# EAGLE design 11A-001 (EAGLE 6.3)

## Sheet 1 of 5
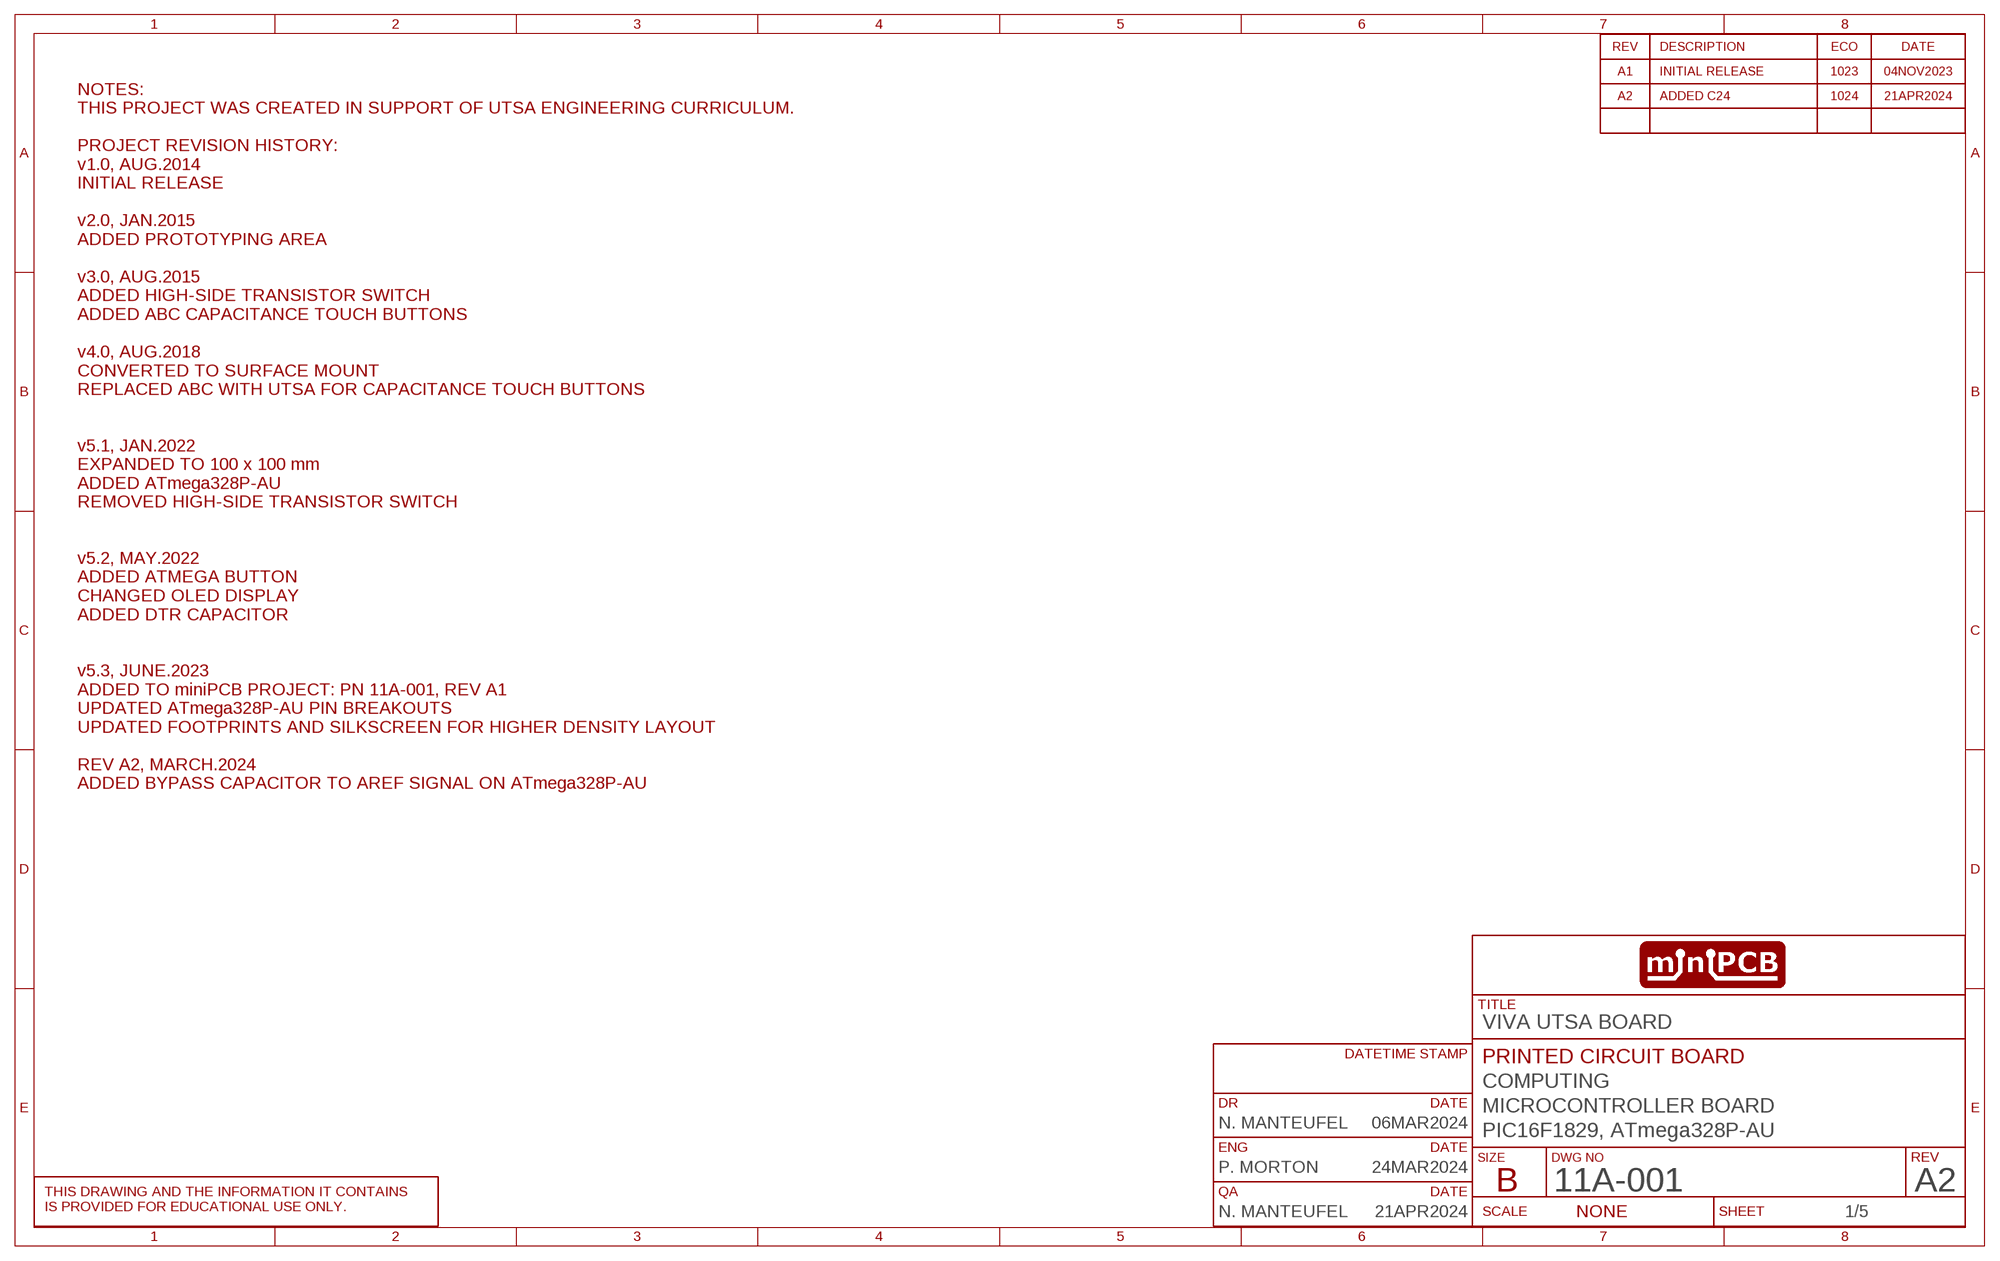
[diagram p0: schematic, sheet 1]
SHEET1 (SCHEMATIC): CIRCUIT_CATEGORY: COMPUTING; CIRCUIT_NAME: MICROCONTROLLER BOARD; CIRCUIT_VARIANT: PIC16F1829, ATmega328P-AU; DR: N. MANTEUFEL; DR_DATE: 06MAR2024; ENG: P. MORTON; ENG_DATE: 24MAR2024; PCB_PCBA: PRINTED CIRCUIT BOARD; QA: N. MANTEUFEL; QA_DATE: 21APR2024; REVA: A1; REVA_DATE: 04NOV2023; REVA_ECO: 1023; REVB: A2; REVB_DATE: 21APR2024; REVB_DESCRIPTION: ADDED C24; REVB_ECO: 1024; REVISION: A2; TITLE: VIVA UTSA BOARD

### Notes on the sheet
- NOTES:
  THIS PROJECT WAS CREATED IN SUPPORT OF UTSA ENGINEERING CURRICULUM.
  
  PROJECT REVISION HISTORY:
  v1.0, AUG.2014
  INITIAL RELEASE
  
  v2.0, JAN.2015
  ADDED PROTOTYPING AREA
  
  v3.0, AUG.2015
  ADDED HIGH-SIDE TRANSISTOR SWITCH
  ADDED ABC CAPACITANCE TOUCH BUTTONS
  
  v4.0, AUG.2018
  CONVERTED TO SURFACE MOUNT
  REPLACED ABC WITH UTSA FOR CAPACITANCE TOUCH BUTTONS
  
  
  v5.1, JAN.2022
  EXPANDED TO 100 x 100 mm
  ADDED ATmega328P-AU
  REMOVED HIGH-SIDE TRANSISTOR SWITCH
  
  
  v5.2, MAY.2022
  ADDED ATMEGA BUTTON
  CHANGED OLED DISPLAY
  ADDED DTR CAPACITOR
  
  
  v5.3, JUNE.2023
  ADDED TO miniPCB PROJECT: PN 11A-001, REV A1
  UPDATED ATmega328P-AU PIN BREAKOUTS
  UPDATED FOOTPRINTS AND SILKSCREEN FOR HIGHER DENSITY LAYOUT
  
  REV A2, MARCH.2024
  ADDED BYPASS CAPACITOR TO AREF SIGNAL ON ATmega328P-AU

## Sheet 2 of 5
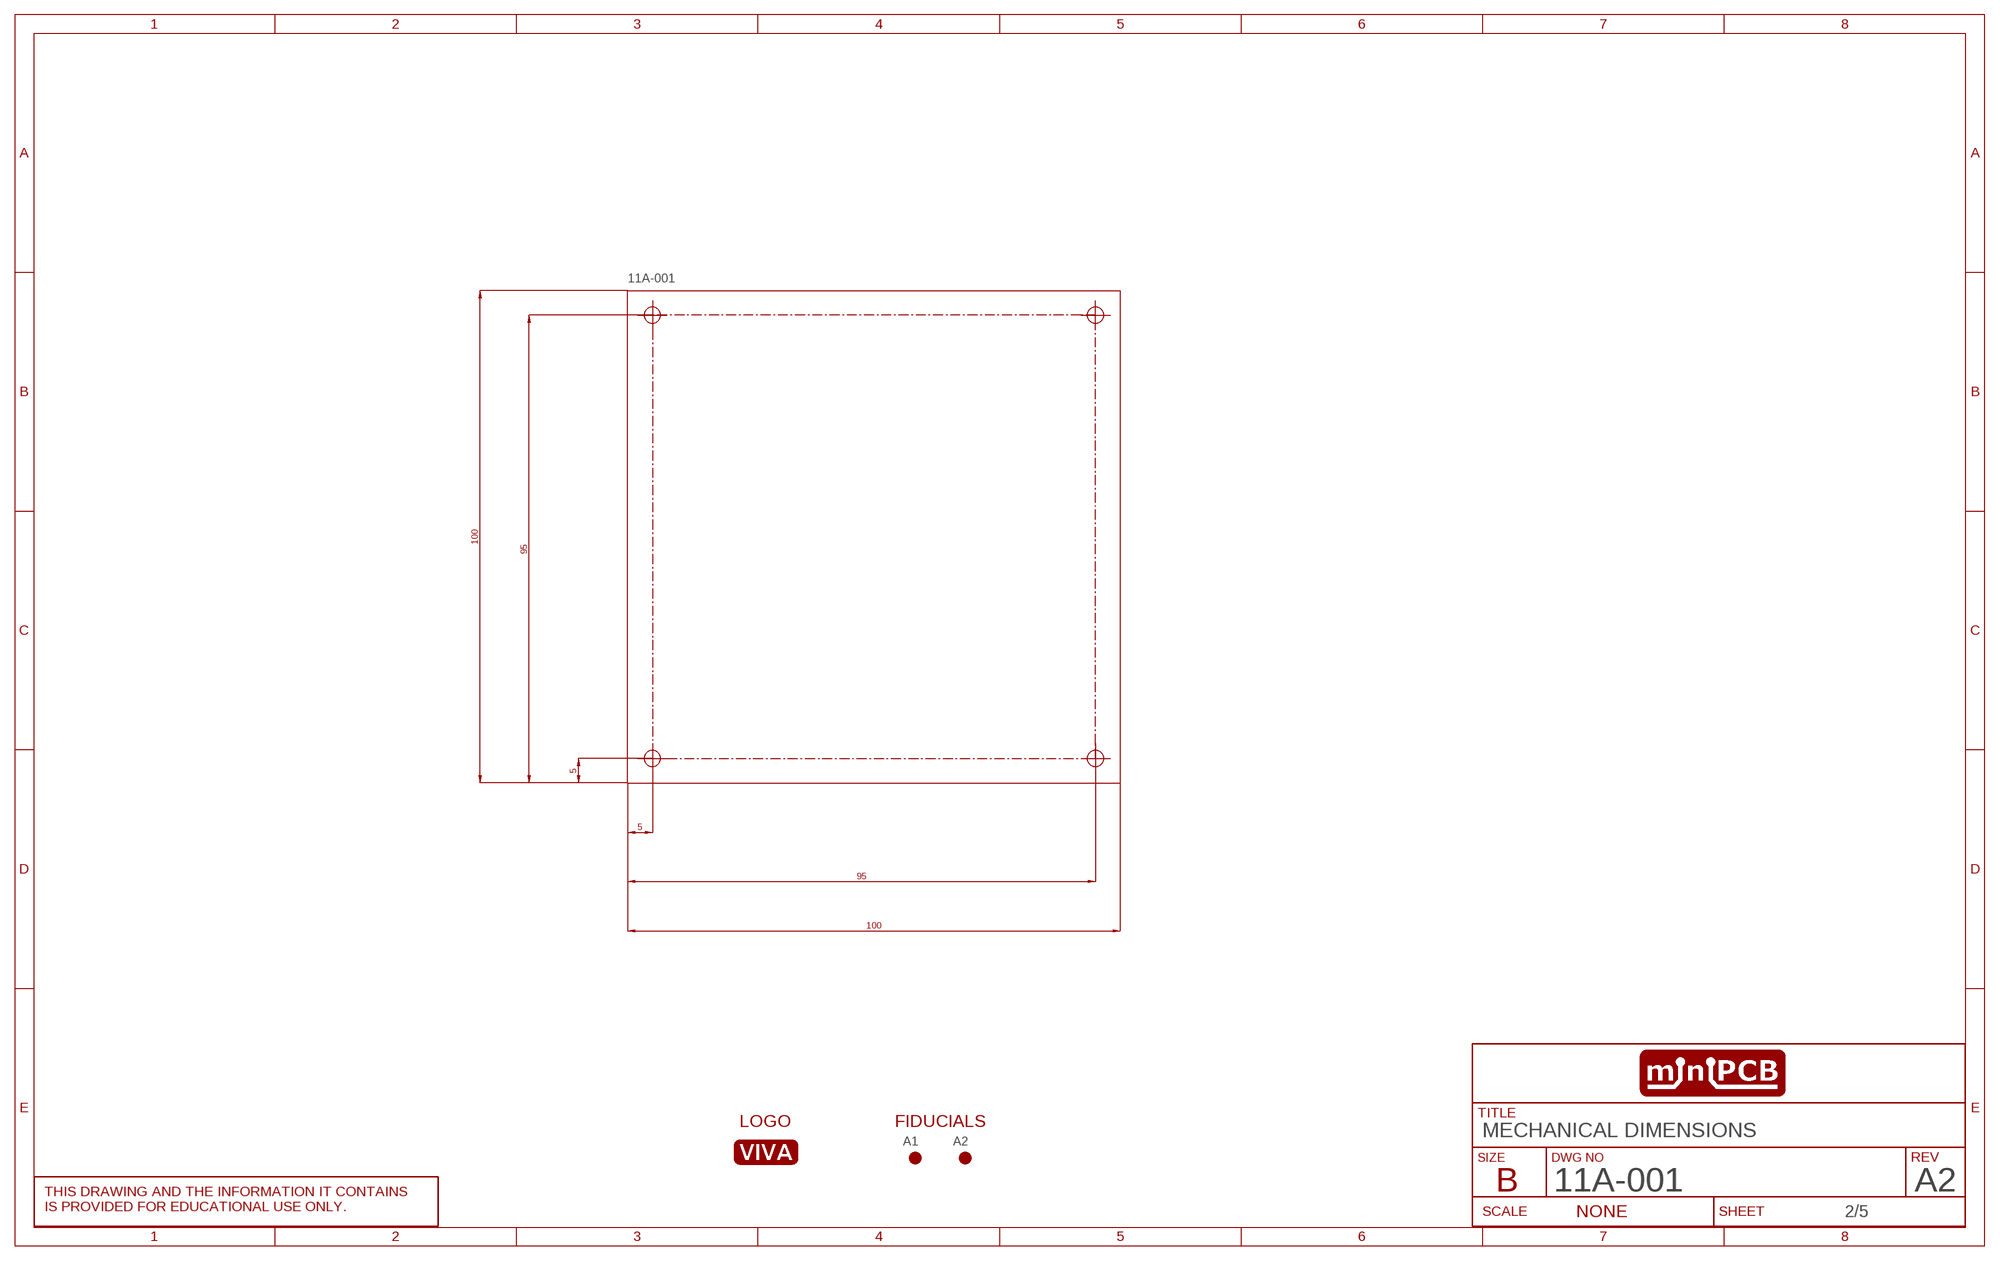
[diagram p1: schematic, sheet 2]
SHEET2 (SCHEMATIC): CIRCUIT_CATEGORY: COMPUTING; CIRCUIT_NAME: MICROCONTROLLER BOARD; CIRCUIT_VARIANT: PIC16F1829, ATmega328P-AU; DR: N. MANTEUFEL; DR_DATE: 31JUL2023; ENG: P. MORTON; ENG_DATE: 31JUL2023; PCB_PCBA: PRINTED CIRCUIT BOARD; REVA: A; REVISION: A2; TITLE: MECHANICAL DIMENSIONS

### Parts
-  11A-001  PCB_100X100  [PCB_100X100]
A1  FIDUCIAL  [FIDUCIAL]
A2  FIDUCIAL  [FIDUCIAL]
U$2  VIVA_LOGO  [VIVA_LOGO]

### Notes on the sheet
- LOGO | FIDUCIALS

## Sheet 3 of 5
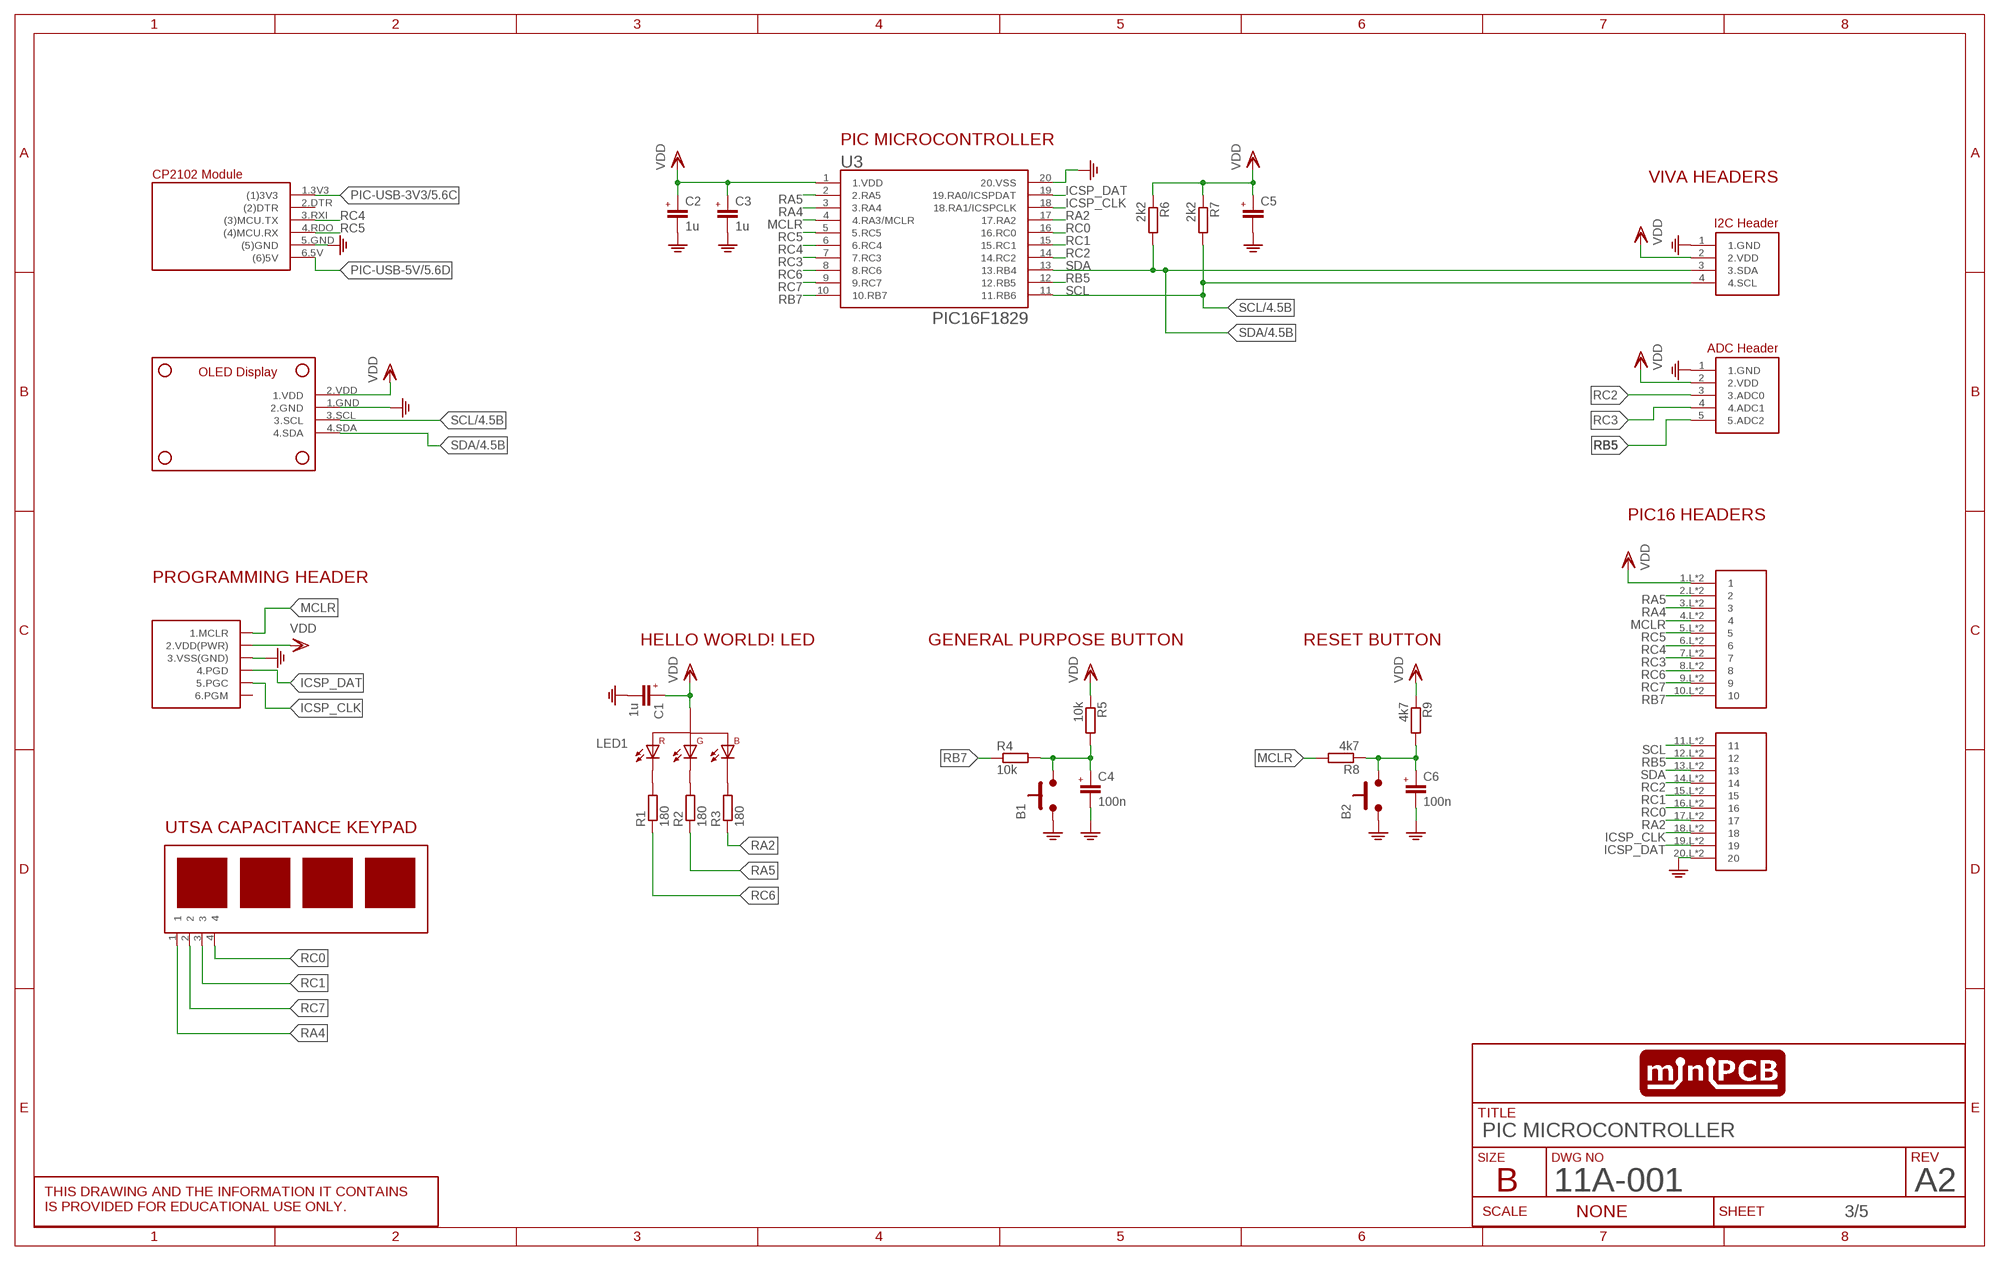
[diagram p2: schematic, sheet 3]
SHEET3 (SCHEMATIC): CIRCUIT_CATEGORY: COMPUTING; CIRCUIT_NAME: MICROCONTROLLER BOARD; CIRCUIT_VARIANT: PIC16F1829, ATmega328P-AU; DR: N. MANTEUFEL; DR_DATE: 31JUL2023; ENG: P. MORTON; ENG_DATE: 31JUL2023; PCB_PCBA: PRINTED CIRCUIT BOARD; REVA: A; REVISION: A2; TITLE: PIC MICROCONTROLLER

### Parts
$3_73_$  VIVA_OLEDGND  [VIVA_OLED-I2C-ALT]
B1  PUSHBUTTON6X6MM  [6X6MM]
B2  PUSHBUTTON6X6MM  [6X6MM]
C1  1u  C0805  [C0805]
C2  1u  C0805  [C0805]
C3  1u  C0805  [C0805]
C4  100n  C0805  [C0805]
C5  C0805  [C0805]
C6  100n  C0805  [C0805]
J1  PICKIT3  [PICKIT3]
J2  VIVA-HEADER-ADC-PIC16  [VIVA-HEADER-ADC-PIC16]
LED1  LED_RGBLTST-C19FD1WT  [0805_RGB]
R1  180  R-EU__R0805  [R0805]
R2  180  R-EU__R0805  [R0805]
R3  180  R-EU__R0805  [R0805]
R4  10k  R-EU__R0805  [R0805]
R5  10k  R-EU__R0805  [R0805]
R6  2k2  R-EU__R0805  [R0805]
R7  2k2  R-EU__R0805  [R0805]
R8  4k7  R-EU__R0805  [R0805]
R9  4k7  R-EU__R0805  [R0805]
U1  VIVA_UTSA-KEYPADV5  [VIVA_UTSA-KEYPAD-V5]
U2  VIVA_USB-TTL  [VIVA_USB_TTL_SUBTEXT]
U3  PIC16F1829  PIC16F1829300  [SOP20-NEW]
U4  VIVA-HEADER-I2C-RA  [VIVA-HEADER-I2C-RA]
U5  VIVA_PIC16BOARD  [VIVA_PIC16]

### Nets
B1-CAP: B1.3.B B1.4.B C4.1(+) R4.2 R5.2
GND: $3_73_$.1.GND(2.GND) B1.1.A B1.2.A B2.1.A B2.2.A C1.2(-) C2.2(-) C3.2(-) C4.2(-) C5.2(-) C6.2(-) J1.3(3.VSS(GND)) J2.1(1.GND) U2.5.GND((5)GND) U3.20(20.VSS) U4.1(1.GND) U5.20.L U5.20.R ; also sheet 4,5
ICSP_CLK: J1.5(5.PGC) U3.18(18.RA1/ICSPCLK) U5.18.L U5.18.R
ICSP_DAT: J1.4(4.PGD) U3.19(19.RA0/ICSPDAT) U5.19.L U5.19.R
MCLR: J1.1(1.MCLR) R8.2 U3.4(4.RA3/MCLR) U5.4.L U5.4.R
MCLR_CAP: B2.3.B B2.4.B C6.1(+) R8.1 R9.2
N$4: LED1.2(1.R-) R1.2
N$5: LED1.3(2.G-) R2.2
N$6: LED1.1(4.B-) R3.2
PIC-USB-3V3: U2.1.3V3((1)3V3) ; also sheet 5
PIC-USB-5V: U2.6.5V((6)5V) ; also sheet 5
RA2: R3.1 U3.17(17.RA2) U5.17.L U5.17.R
RA4: U1.1 U3.3(3.RA4) U5.3.L U5.3.R
RA5: R2.1 U3.2(2.RA5) U5.2.L U5.2.R
RB5: J2.5(5.ADC2) U3.12(12.RB5) U5.12.L U5.12.R
RB7: R4.1 U3.10(10.RB7) U5.10.L U5.10.R
RC0: U1.4 U3.16(16.RC0) U5.16.L U5.16.R
RC1: U1.3 U3.15(15.RC1) U5.15.L U5.15.R
RC2: J2.3(3.ADC0) U3.14(14.RC2) U5.14.L U5.14.R
RC3: J2.4(4.ADC1) U3.7(7.RC3) U5.7.L U5.7.R
RC4: U2.3.RXI((3)MCU.TX) U3.6(6.RC4) U5.6.L U5.6.R
RC5: U2.4.RDO((4)MCU.RX) U3.5(5.RC5) U5.5.L U5.5.R
RC6: R1.1 U3.8(8.RC6) U5.8.L U5.8.R
RC7: U1.2 U3.9(9.RC7) U5.9.L U5.9.R
SCL: $3_73_$.3.SCL R7.2 U3.11(11.RB6) U4.4(4.SCL) U5.11.L U5.11.R ; also sheet 4
SDA: $3_73_$.4.SDA R6.2 U3.13(13.RB4) U4.3(3.SDA) U5.13.L U5.13.R ; also sheet 4
VDD: $3_73_$.2.VDD(1.VDD) C1.1(+) C2.1(+) C3.1(+) C5.1(+) J1.2(2.VDD(PWR)) J2.2(2.VDD) LED1.4(3.+) R5.1 R6.1 R7.1 R9.1 U3.1(1.VDD) U4.2(2.VDD) U5.1.L U5.1.R ; also sheet 4,5
Unconnected: J1.6(6.PGM) U2.2.DTR((2)DTR)

### Notes on the sheet
- PIC MICROCONTROLLER
- VIVA HEADERS
- PIC16 HEADERS
- PROGRAMMING HEADER
- HELLO WORLD! LED | GENERAL PURPOSE BUTTON | RESET BUTTON
- UTSA CAPACITANCE KEYPAD

## Sheet 4 of 5
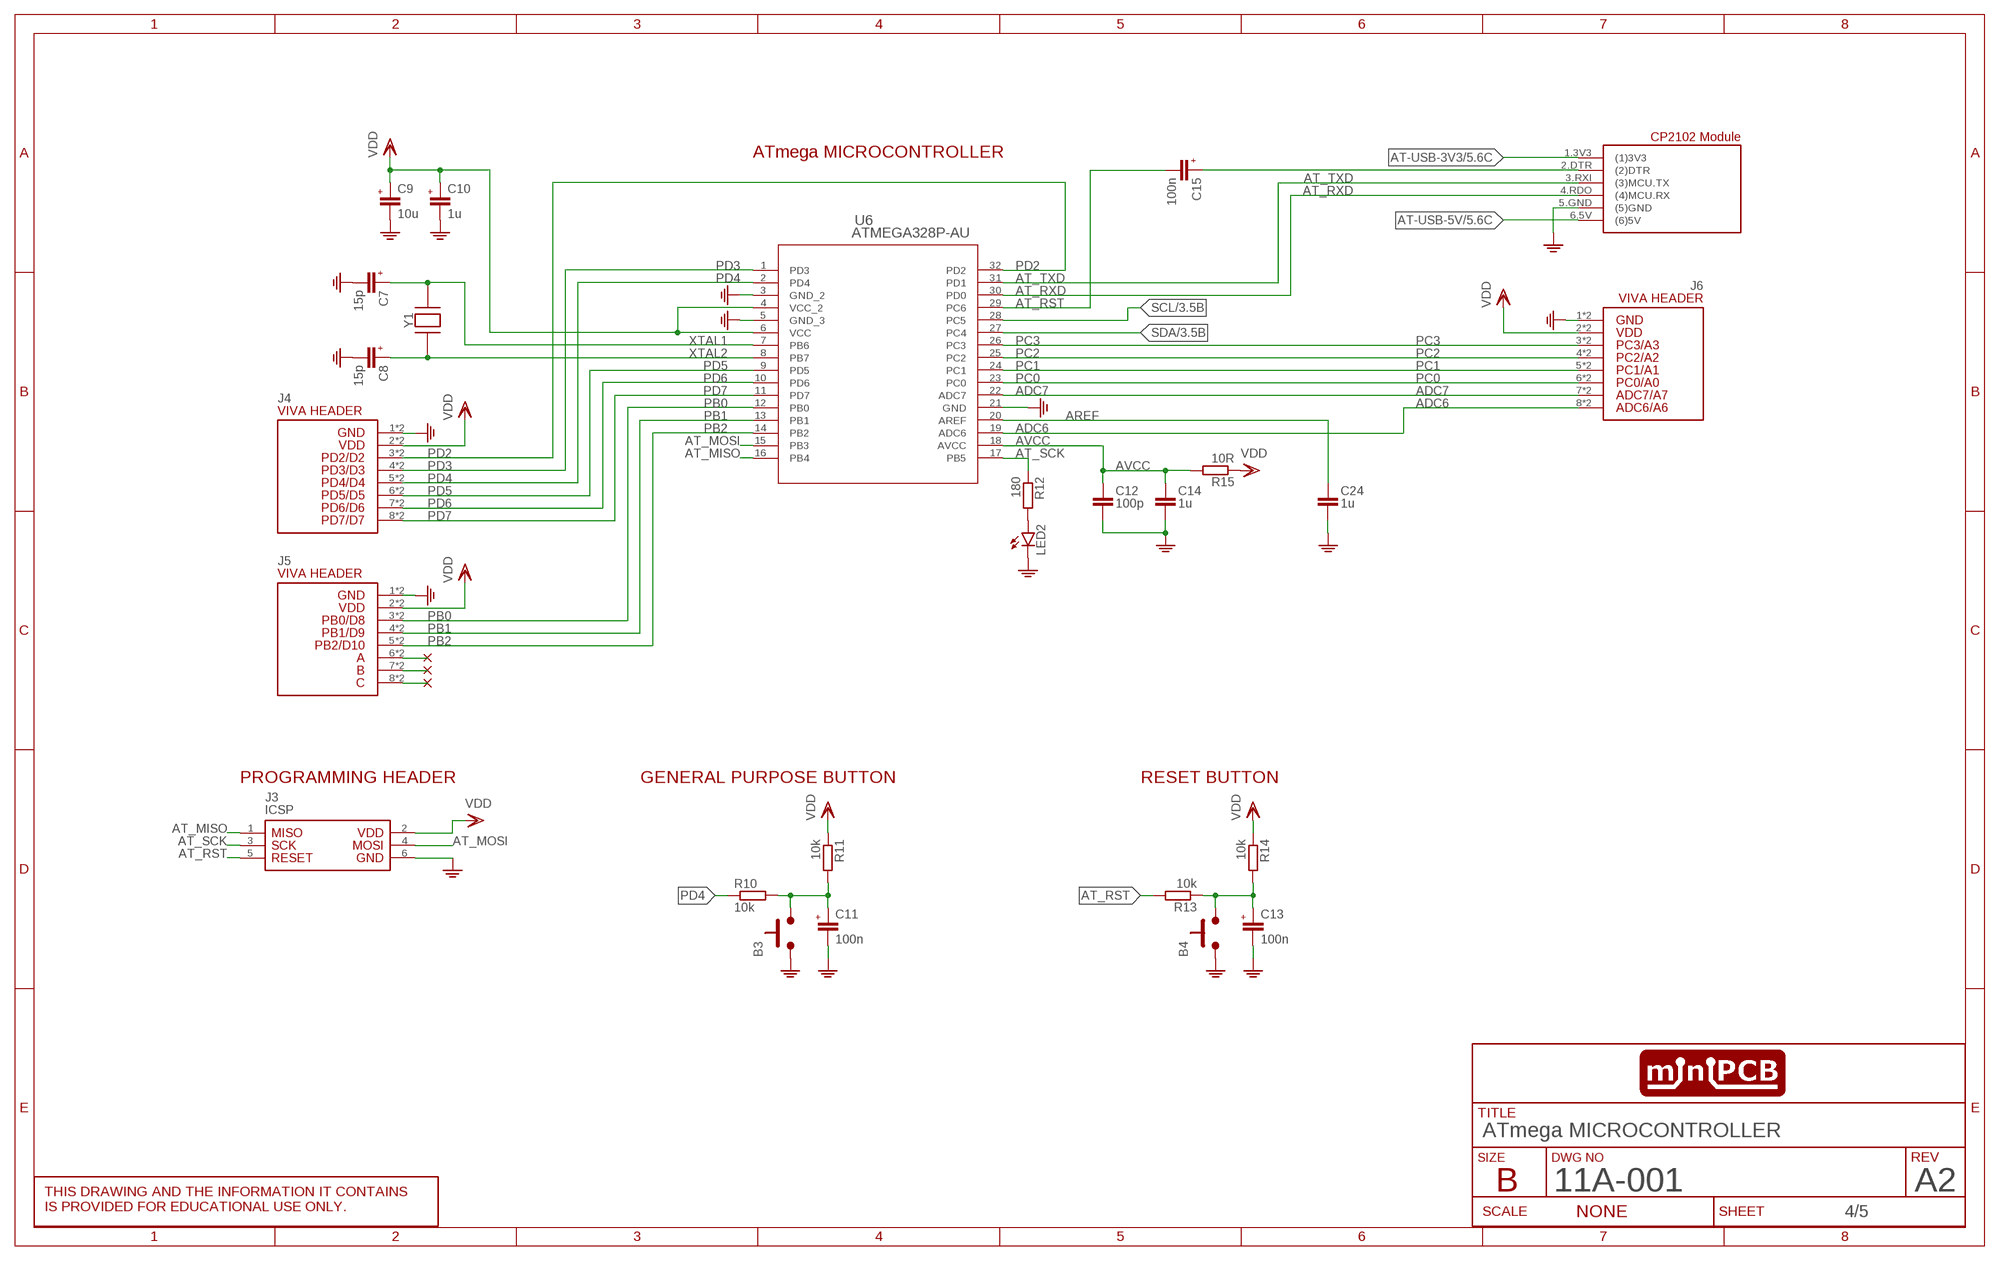
[diagram p3: schematic, sheet 4]
SHEET4 (SCHEMATIC): CIRCUIT_CATEGORY: COMPUTING; CIRCUIT_NAME: MICROCONTROLLER BOARD; CIRCUIT_VARIANT: PIC16F1829, ATmega328P-AU; DR: N. MANTEUFEL; DR_DATE: 31JUL2023; ENG: P. MORTON; ENG_DATE: 31JUL2023; PCB_PCBA: PRINTED CIRCUIT BOARD; REVA: A; REVISION: A2; TITLE: ATmega MICROCONTROLLER

### Parts
B3  PUSHBUTTON6X6MM  [6X6MM]
B4  PUSHBUTTON6X6MM  [6X6MM]
C7  15p  C0603  [C0603]
C8  15p  C0603  [C0603]
C9  10u  C0805  [C0805]
C10  1u  C0805  [C0805]
C11  100n  C0805  [C0805]
C12  100p  C-EU_C0805  [C0805]
C13  100n  C0805  [C0805]
C14  1u  C-EU_C0805  [C0805]
C15  100n  C0805  [C0805]
C24  1u  C-EU_C0805  [C0805]
J3  ICSP  PINS_6-2X3_AT  [PINS_6-2X3_AT]
J4  VIVA-HEADER-ADC-8P  [VIVA-HEADER-ADC-8P]
J5  VIVA-HEADER-ADC-8P  [VIVA-HEADER-ADC-8P]
J6  VIVA-HEADER-ADC-8P  [VIVA-HEADER-ADC-8P]
LED2  LEDSML0805  [SML0805]
R10  10k  R-EU__R0805  [R0805]
R11  10k  R-EU__R0805  [R0805]
R12  180  R-EU__R0805  [R0805]
R13  10k  R-EU__R0805  [R0805]
R14  10k  R-EU__R0805  [R0805]
R15  10R  R-EU__R0805  [R0805]
U6  ATMEGA328P-AU  ATMEGA328-AU  [32A_ATM]
U7  VIVA_USB-TTL  [VIVA_USB_TTL_SUBTEXT]
Y1  CRYSTAL-3225_4P  [TXC7M2]

### Nets
ADC6: J6.8(8.ADC5) J6.9(8.ADC5) U6.19(ADC6)
ADC7: J6.7(7.ADC4) J6.10(7.ADC4) U6.22(ADC7)
AREF: C24.1 U6.20(AREF)
AT-USB-3V3: U7.1.3V3((1)3V3) ; also sheet 5
AT-USB-5V: U7.6.5V((6)5V) ; also sheet 5
AT_DTR_CAP: C15.1(+) U7.2.DTR((2)DTR)
AT_MISO: J3.1 U6.16(PB4)
AT_MOSI: J3.4 U6.15(PB3)
AT_RST: C15.2(-) J3.5 R13.2 U6.29(PC6)
AT_RST_CAP: B4.3.B B4.4.B C13.1(+) R13.1 R14.2
AT_RXD: U6.30(PD0) U7.4.RDO((4)MCU.RX)
AT_SCK: J3.3 R12.1 U6.17(PB5)
AT_TXD: U6.31(PD1) U7.3.RXI((3)MCU.TX)
AVCC: C12.1 C14.1 R15.2 U6.18(AVCC)
GND: B3.1.A B3.2.A B4.1.A B4.2.A C7.1(-) C8.1(-) C9.2(-) C10.2(-) C11.2(-) C12.2 C13.2(-) C14.2 C24.2 J3.6 J4.1(1.GND) J4.16(1.GND) J5.1(1.GND) J5.16(1.GND) J6.1(1.GND) J6.16(1.GND) LED2.C U6.3(GND_2) U6.5(GND_3) U6.21(GND) U7.5.GND((5)GND) ; also sheet 3,5
N$33: J5.6(6.ADC3) J5.11(6.ADC3)
N$34: J5.7(7.ADC4) J5.10(7.ADC4)
N$35: J5.8(8.ADC5) J5.9(8.ADC5)
N$37: LED2.A R12.2
PB0: J5.3(3.ADC0) J5.14(3.ADC0) U6.12(PB0)
PB1: J5.4(4.ADC1) J5.13(4.ADC1) U6.13(PB1)
PB2: J5.5(5.ADC2) J5.12(5.ADC2) U6.14(PB2)
PC0: J6.6(6.ADC3) J6.11(6.ADC3) U6.23(PC0)
PC1: J6.5(5.ADC2) J6.12(5.ADC2) U6.24(PC1)
PC2: J6.4(4.ADC1) J6.13(4.ADC1) U6.25(PC2)
PC3: J6.3(3.ADC0) J6.14(3.ADC0) U6.26(PC3)
PD2: J4.3(3.ADC0) J4.14(3.ADC0) U6.32(PD2)
PD3: J4.4(4.ADC1) J4.13(4.ADC1) U6.1(PD3)
PD4: J4.5(5.ADC2) J4.12(5.ADC2) R10.1 U6.2(PD4)
PD4-CAP: B3.3.B B3.4.B C11.1(+) R10.2 R11.2
PD5: J4.6(6.ADC3) J4.11(6.ADC3) U6.9(PD5)
PD6: J4.7(7.ADC4) J4.10(7.ADC4) U6.10(PD6)
PD7: J4.8(8.ADC5) J4.9(8.ADC5) U6.11(PD7)
SCL: U6.28(PC5) ; also sheet 3
SDA: U6.27(PC4) ; also sheet 3
VDD: C9.1(+) C10.1(+) J3.2 J4.2(2.VDD) J4.15(2.VDD) J5.2(2.VDD) J5.15(2.VDD) J6.2(2.VDD) J6.15(2.VDD) R11.1 R14.1 R15.1 U6.4(VCC_2) U6.6(VCC) ; also sheet 3,5
XTAL1: C7.2(+) U6.7(PB6) Y1.3
XTAL2: C8.2(+) U6.8(PB7) Y1.1

### Notes on the sheet
- ATmega MICROCONTROLLER
- PROGRAMMING HEADER | GENERAL PURPOSE BUTTON | RESET BUTTON

## Sheet 5 of 5
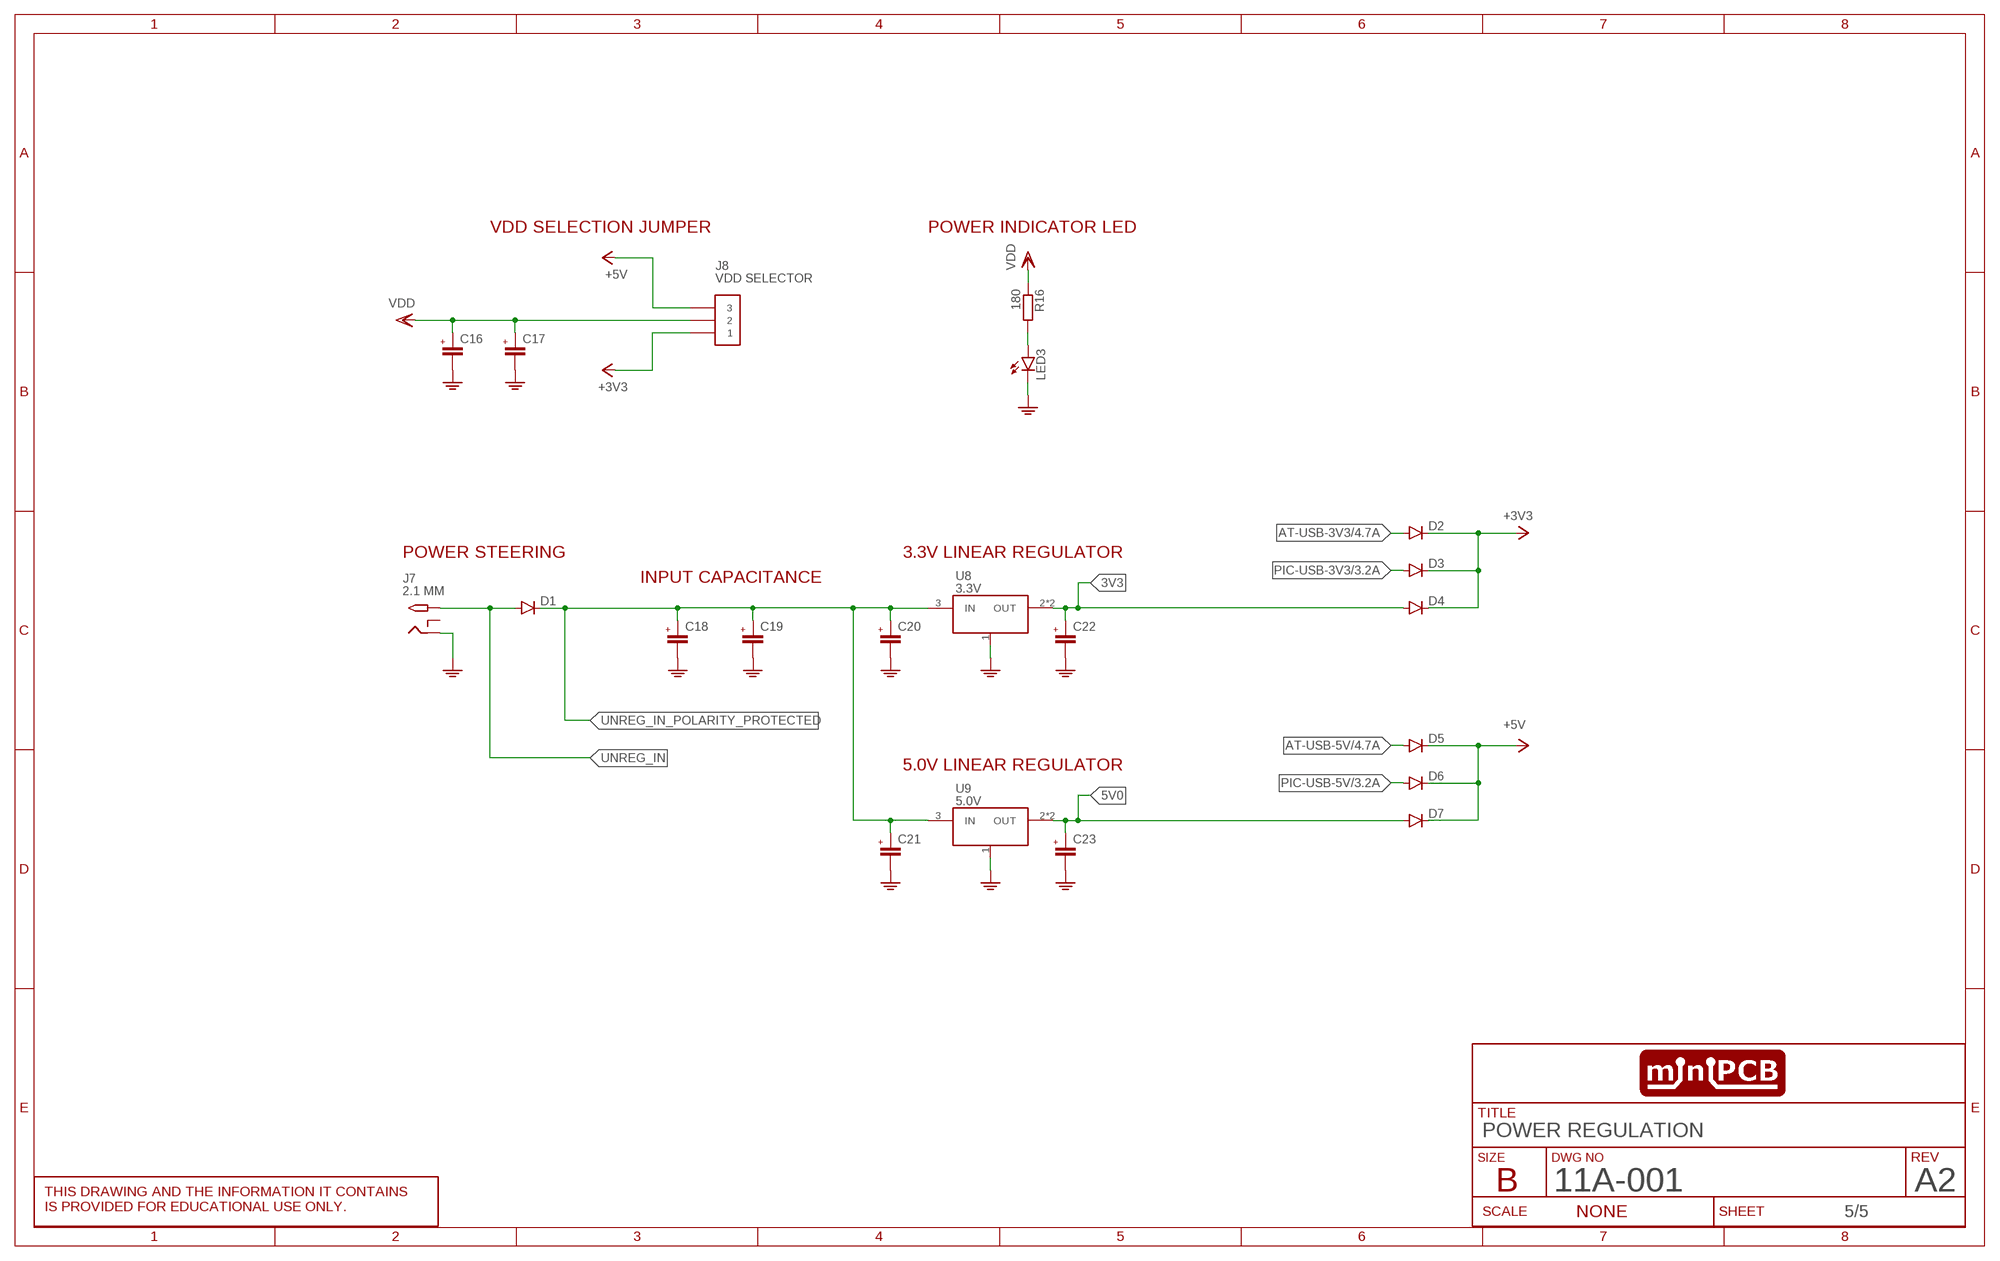
[diagram p4: schematic, sheet 5]
SHEET5 (SCHEMATIC): CIRCUIT_CATEGORY: COMPUTING; CIRCUIT_NAME: MICROCONTROLLER BOARD; CIRCUIT_VARIANT: PIC16F1829, ATmega328P-AU; DR: N. MANTEUFEL; DR_DATE: 31JUL2023; ENG: P. MORTON; ENG_DATE: 31JUL2023; PCB_PCBA: PRINTED CIRCUIT BOARD; REVA: A; REVISION: A2; TITLE: POWER REGULATION

### Parts
C16  C0805  [C0805]
C17  C0805  [C0805]
C18  C0805  [C0805]
C19  C0805  [C0805]
C20  C0805  [C0805]
C21  C0805  [C0805]
C22  C0805  [C0805]
C23  C0805  [C0805]
D1  DIODE-DO214AC  [DO214AC]
D2  DIODE-DO214AC  [DO214AC]
D3  DIODE-DO214AC  [DO214AC]
D4  DIODE-DO214AC  [DO214AC]
D5  DIODE-DO214AC  [DO214AC]
D6  DIODE-DO214AC  [DO214AC]
D7  DIODE-DO214AC  [DO214AC]
J7  2.1 MM  2.1MMJACKTHM  [PJ-102A]
J8  VDD SELECTOR  PINS_3_2.54  [PINS_3]
LED3  LEDSML0805  [SML0805]
R16  180  R-EU__R0805  [R0805]
U8  3.3V  REGULATOR_SCHLM1117  [SOT223]
U9  5.0V  REGULATOR_SCHLM1117  [SOT223]

### Nets
3V3: C22.1(+) D4.A U8.2(OUT) U8.4.TAB(OUT)
5V0: C23.1(+) D7.A U9.2(OUT) U9.4.TAB(OUT)
+3V3: D2.C D3.C D4.C J8.1
+5V: D5.C D6.C D7.C J8.3
AT-USB-3V3: D2.A ; also sheet 4
AT-USB-5V: D5.A ; also sheet 4
GND: C16.2(-) C17.2(-) C18.2(-) C19.2(-) C20.2(-) C21.2(-) C22.2(-) C23.2(-) J7.RING LED3.C U8.1(GND) U9.1(GND) ; also sheet 3,4
LED_POWER: LED3.A R16.2
PIC-USB-3V3: D3.A ; also sheet 3
PIC-USB-5V: D6.A ; also sheet 3
UNREG_IN: D1.A J7.TIP
UNREG_IN_POLARITY_PROTECTED: C18.1(+) C19.1(+) C20.1(+) C21.1(+) D1.C U8.3(IN) U9.3(IN)
VDD: C16.1(+) C17.1(+) J8.2 R16.1 ; also sheet 3,4
Unconnected: J7.RING_SW

### Notes on the sheet
- VDD SELECTION JUMPER | POWER INDICATOR LED
- POWER STEERING | 3.3V LINEAR REGULATOR
- INPUT CAPACITANCE
- 5.0V LINEAR REGULATOR

## Library data of the parts
$3_73_$ = utsa:VIVA_OLED
- = utsa:PCB_100X100
A1 A2 = utsa:FIDUCIAL
B1-B4 = nolan-utsa:PUSHBUTTON: Tactile push button switch
C1-C11 C13 C15-C23 = utsa:C
C12 C14 C24 = utsa:C-EU: CAPACITOR, European symbol
D1-D7 = utsa:DIODE-: DIODE
J1 = nolan-viva:PICKIT3
J2 = utsa:VIVA-HEADER-ADC
J3 = utsa:PINS_6-2X3_AT; P1: MISO; P2: VDD; P3: SCK; P4: MOSI; P5: RESET; P6: GND
J4 = utsa:VIVA-HEADER-ADC-8P; P3: PD2/D2; P4: PD3/D3; P5: PD4/D4; P6: PD5/D5; P7: PD6/D6; P8: PD7/D7
J5 = utsa:VIVA-HEADER-ADC-8P; P3: PB0/D8; P4: PB1/D9; P5: PB2/D10; P6: A; P7: B; P8: C
J6 = utsa:VIVA-HEADER-ADC-8P; P3: PC3/A3; P4: PC2/A2; P5: PC1/A1; P6: PC0/A0; P7: ADC7/A7; P8: ADC6/A6
J7 = utsa:2.1MMJACK: 2.1mm x 5.5mm THM DC jack with internal switch. Digikey part #PJ-102A, 4UCON part #05537 2.1mm x 5.5mm SMT DC jack with internal switch. Digikey part #PJ-002A-SMT, 4UCON part #03267 By microbuilder.eu & adafruit.com
J8 = utsa:PINS_3
LED1 = utsa:LED_RGB
LED2 LED3 = utsa:LED: LED OSRAM: - CHIPLED LG R971, LG N971, LY N971, LG Q971, LY Q971, LO R971, LY R971 LH N974, LH R974 LS Q976, LO Q976, LY Q976 LO Q996 - Hyper CHIPLED LW Q18S LB Q993, LB Q99A, LB R99A - SideLED LS A670, LO A670, LY A670, LG A670, LP A670 LB A673, LV A673, LT A673, LW A673 LH A674 LY A675 LS A676, LA A676, LO A676, LY A676, LW A676 LS A679, LY A679, LG A679 - Hyper Micro SIDELED® LS Y876, LA Y876, LO Y876, LY Y876 LT Y87S - SmartLED LW L88C, LW L88S LB L89C, LB L89S, LG L890 LS L89K, LO L89K, LY L89K LS L896, LA L896, LO L896, LY L896 - TOPLED LS T670, LO T670, LY T670, LG T670, LP T670 LSG T670, LSP T670, LSY T670, LOP T670, LYG T670 LG T671, LOG T671, LSG T671 LB T673, LV T673, LT T673, LW T673 LH T674 LS T676, LA T676, LO T676, LY T676, LB T676, LH T676, LSB T676, LW T676 LB T67C, LV T67C, LT T67C, LS T67K, LO T67K, LY T67K, LW E67C LS E67B, LA E67B, LO E67B, LY E67B, LB E67C, LV E67C, LT E67C LW T67C LS T679, LY T679, LG T679 LS T770, LO T770, LY T770, LG T770, LP T770 LB T773, LV T773, LT T773, LW T773 LH T774 LS E675, LA E675, LY E675, LS T675 LS T776, LA T776, LO T776, LY T776, LB T776 LHGB T686 LT T68C, LB T68C - Hyper Mini TOPLED® LB M676 - Mini TOPLED Santana® LG M470 LS M47K, LO M47K, LY M47K Source: http://www.osram.convergy.de LUXEON: - LUMILED® LXK2-PW12-R00, LXK2-PW12-S00, LXK2-PW14-U00, LXK2-PW14-V00 LXK2-PM12-R00, LXK2-PM12-S00, LXK2-PM14-U00 LXK2-PE12-Q00, LXK2-PE12-R00, LXK2-PE12-S00, LXK2-PE14-T00, LXK2-PE14-U00 LXK2-PB12-K00, LXK2-PB12-L00, LXK2-PB12-M00, LXK2-PB14-N00, LXK2-PB14-P00, LXK2-PB14-Q00 LXK2-PR12-L00, LXK2-PR12-M00, LXK2-PR14-Q00, LXK2-PR14-R00 LXK2-PD12-Q00, LXK2-PD12-R00, LXK2-PD12-S00 LXK2-PH12-R00, LXK2-PH12-S00 LXK2-PL12-P00, LXK2-PL12-Q00, LXK2-PL12-R00 Source: www.luxeon.com KINGBRIGHT: KA-3528ASYC Source: www.kingbright.com
R1-R16 = utsa:R-EU_: RESISTOR, European symbol
U1 = utsa:VIVA_UTSA-KEYPAD
U2 U7 = utsa:VIVA_USB-TTL
U3 = utsa:PIC16F1829
U4 = utsa:VIVA-HEADER-I2C
U5 = utsa:VIVA_PIC16
U6 = utsa:ATMEGA328-AU; COPYRIGHT: Copyright (C) 2021 Ultra Librarian. All rights reserved.; MANUFACTURER_PART_NUMBER: ATMEGA328-AU; MFR_NAME: Microchip
U8 U9 = utsa:REGULATOR_SCH: Linear Regulator in SOT-223 package. NOTE: select correct pinout for your application. Tab may be OUT or GND!
U$2 = utsa:VIVA_LOGO
Y1 = utsa:CRYSTAL: HC49S Crystal Oscillator

## Board
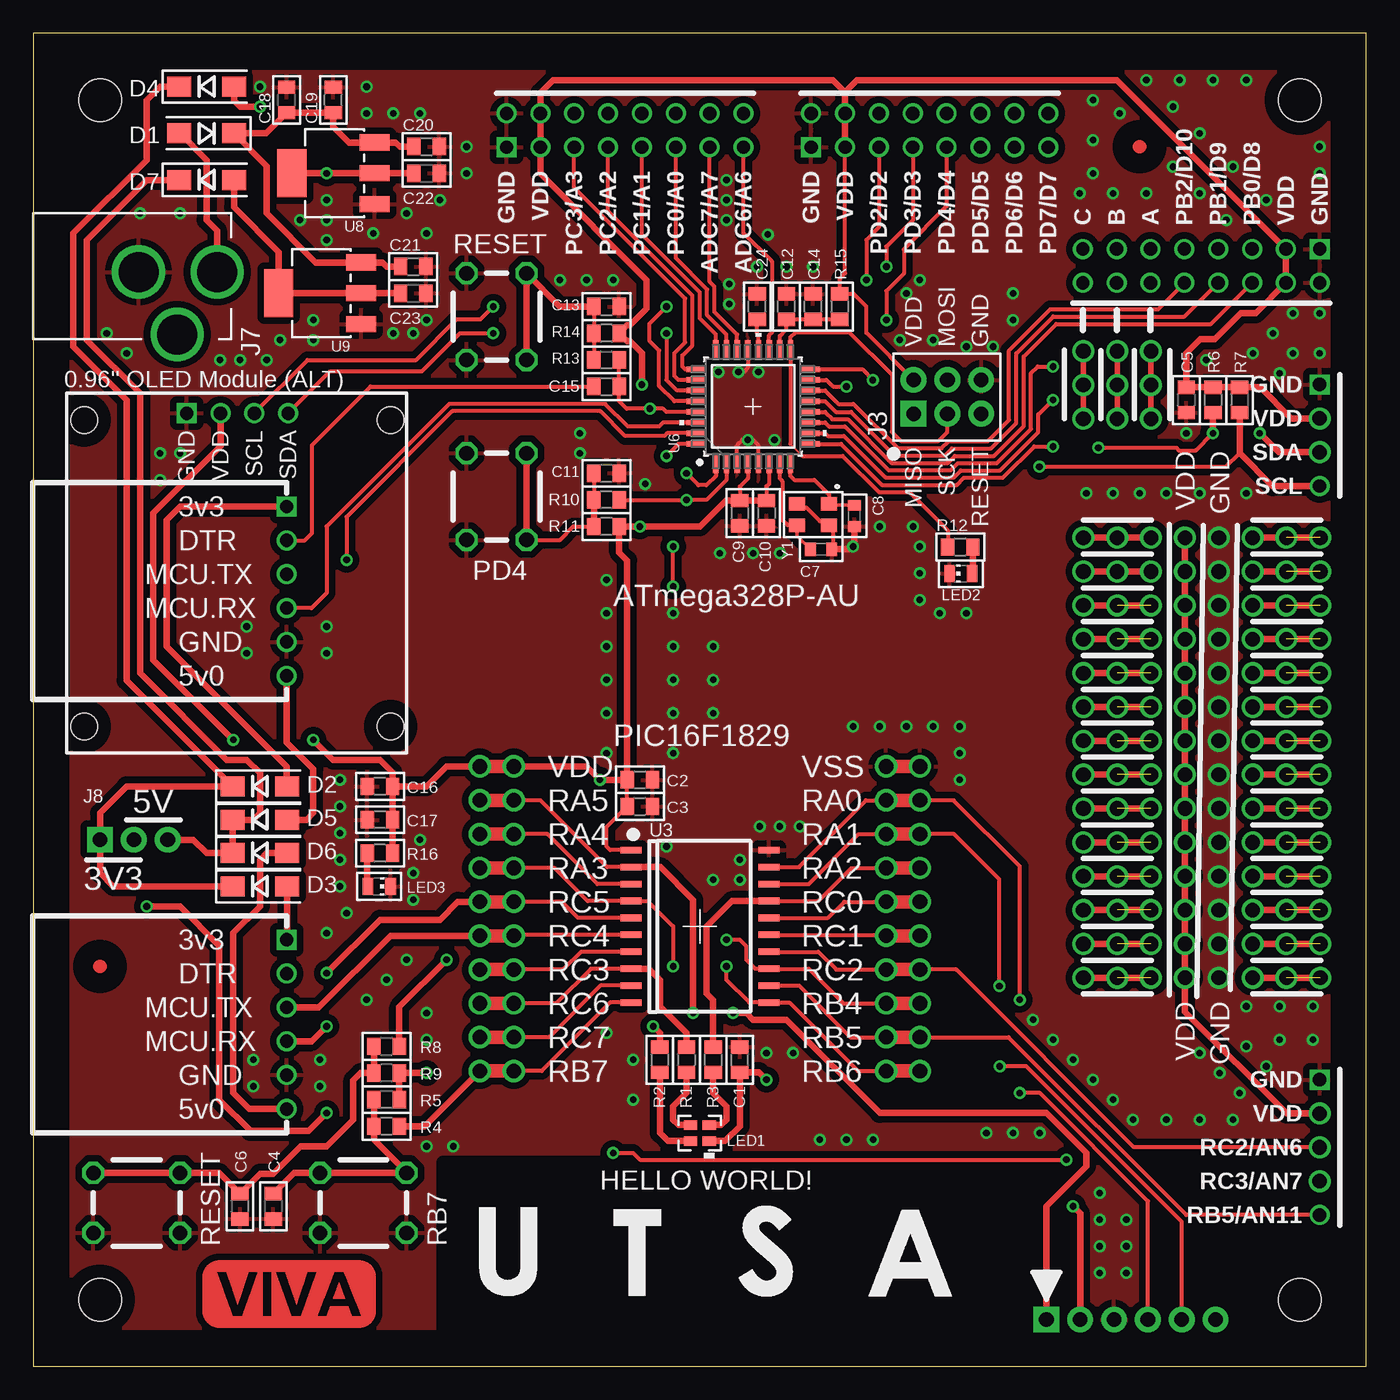
[diagram p5: board, top side]
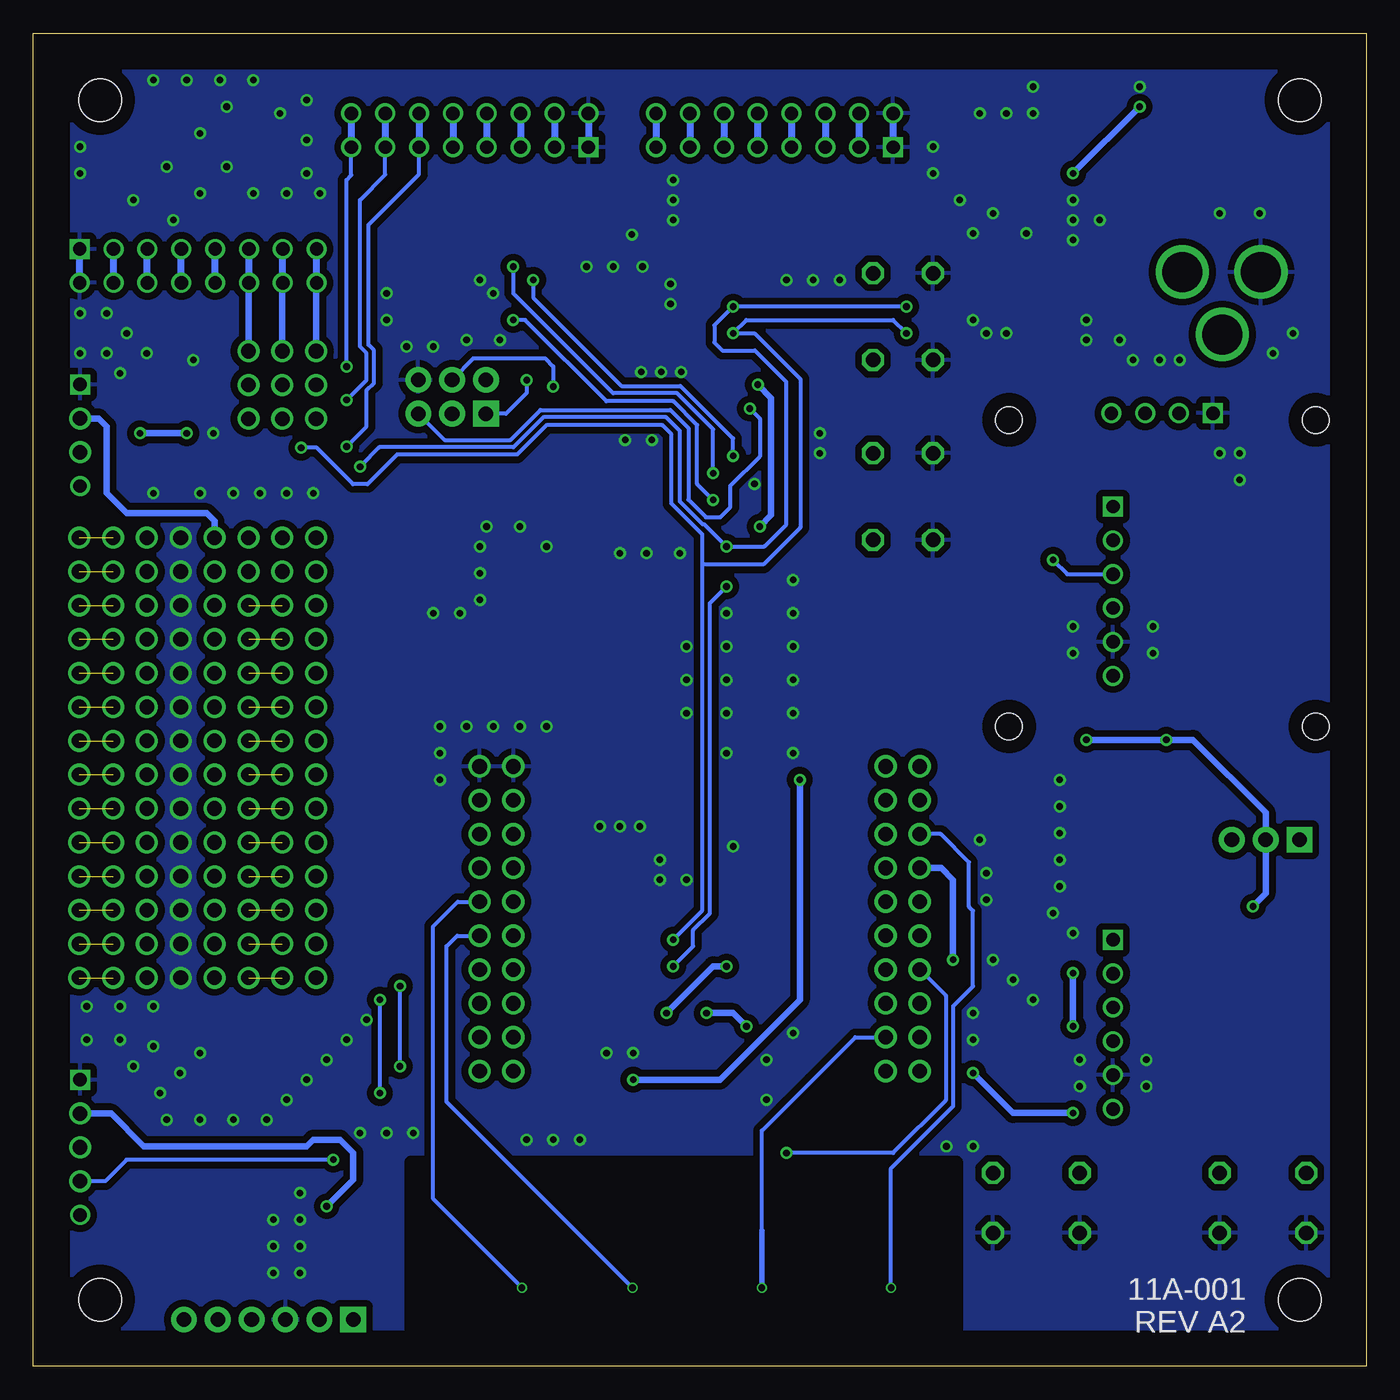
[diagram p6: board, bottom side, seen from below]

Size 100 x 100 mm. Coordinates in mm from the lower left corner, seen from the top.
Copper layers (1*16): Top 0.035mm / dielectric 1.5mm / Bottom 0.035mm
Design rules "minipcb *": minimum track width 0.2mm, minimum drill 0.5mm, track to track 0.2mm, track to pad 0.3mm, pad to pad 0.3mm, via to via 0.3mm, smd to smd 0.15mm, copper to edge 1mm, drill to drill 0.9mm, minimum pad ring 0.1mm, minimum via ring 0.1mm, stop-mask expansion 0.1mm, vias tented up to drill 0.6mm, thermal gap 0.5mm

### Footprints (pad centres in the part's own frame; a part is rotated, then mirrored left to right if it is on the bottom)
VIVA_OLED-I2C-ALT = drill 1 square: 1.GND 0,0 | drill 1: 2.VDD 2.54,0; 3.SCL 5.08,0; 4.SDA 7.62,0 | hole 2: -7.7,-0.5; 15.3,-0.5; -7.7,-23.5; 15.3,-23.5
PCB_100X100 = hole 3.2: 5,95; 95,95; 95,5; 5,5
FIDUCIAL = smd 0 x 0: FIDUCIAL 0,0
6X6MM = drill 1.1 octagon: 1.A 0,0; 2.A 6.5,0; 3.B 0,4.5; 4.B 6.5,4.5
C0805 = smd 1 x 1.3: 1 -0.95,0; 2 0.95,0
C0603 = smd 0.8 x 1: 1 -0.8,0; 2 0.8,0
DO214AC = smd 1.8 x 1.5: A 2.05,0; C -2.05,0
PICKIT3 = drill 1.1 pad 1.93 square: 1 0,0 | drill 1.1 pad 1.93: 2 2.54,0; 3 5.08,0; 4 7.62,0; 5 10.16,0; 6 12.7,0
VIVA-HEADER-ADC-PIC16 = drill 1 square: 1 0,0 | drill 1.1: 2 2.54,0; 3 5.08,0; 4 7.62,0 | drill 1: 5 10.16,0
PINS_6-2X3_AT = drill 1.1 pad 1.93 square: 1 0,0 | drill 1.1 pad 1.93: 2 2.54,0; 3 0,-2.54; 4 2.54,-2.54; 5 0,-5.08; 6 2.54,-5.08
VIVA-HEADER-ADC-8P = drill 1 square: 1 0,0 | drill 1: 2 2.54,0; 3 5.08,0; 4 7.62,0; 5 10.16,0; 6 12.7,0; 7 15.24,0; 8 17.78,0; 9 17.78,2.54; 10 15.24,2.54; 11 12.7,2.54; 12 10.16,2.54; 13 7.62,2.54; 14 5.08,2.54; 15 2.54,2.54; 16 0,2.54
PJ-102A = drill 3 pad 4: RING 0.1,-3.39; RING_SW -4.6,-6.29; TIP 0.1,-9.29
PINS_3 = drill 1.1 pad 1.93 square: 1 0,0 | drill 1.1 pad 1.93: 2 2.54,0; 3 5.08,0
0805_RGB = smd 1 x 0.7: 1 0.7,0.6; 2 -0.7,0.6; 3 -0.7,-0.6; 4 0.7,-0.6
SML0805 = smd 0.8 x 1.27: A -0.9,0; C 0.8,0
R0805 = smd 1 x 1.3: 1 -0.95,0; 2 0.95,0
VIVA_UTSA-KEYPAD-V5 = drill 0.5: 1 -14.36,4.38; 2 -4.66,4.38; 3 5.04,4.38; 4 13.34,4.38
VIVA_USB_TTL_SUBTEXT = drill 1 square: 1.3V3 0,0 | drill 1: 2.DTR 0,-2.54; 3.RXI 0,-5.08; 4.RDO 0,-7.62; 5.GND 0,-10.16; 6.5V 0,-12.7
SOP20-NEW = smd 0.5 x 1.6: 1 -5.715,-5.152; 2 -4.445,-5.152; 3 -3.175,-5.152; 4 -1.905,-5.152; 5 -0.635,-5.152; 6 0.635,-5.152; 7 1.905,-5.152; 8 3.175,-5.152; 9 4.445,-5.152; 10 5.715,-5.152; 11 5.715,5.188; 12 4.445,5.188; 13 3.175,5.188; 14 1.905,5.188; 15 0.635,5.188; 16 -0.635,5.188; 17 -1.905,5.188; 18 -3.175,5.188; 19 -4.445,5.188; 20 -5.715,5.188
VIVA-HEADER-I2C-RA = drill 1 square: 1 0,0 | drill 1.1: 2 2.54,0; 3 5.08,0 | drill 1: 4 7.62,0
VIVA_PIC16 = drill 1.1 pad 1.676: 1.L 0,0; 1.R 2.54,0; 2.L 0,-2.54; 2.R 2.54,-2.54; 3.L 0,-5.08; 3.R 2.54,-5.08; 4.L 0,-7.62; 4.R 2.54,-7.62; 5.L 0,-10.16; 5.R 2.54,-10.16; 6.L 0,-12.7; 6.R 2.54,-12.7; 7.L 0,-15.24; 7.R 2.54,-15.24; 8.L 0,-17.78; 8.R 2.54,-17.78; 9.L 0,-20.32; 9.R 2.54,-20.32; 10.L 0,-22.86; 10.R 2.54,-22.86; 11.L 30.48,-22.86; 11.R 33.02,-22.86; 12.L 30.48,-20.32; 12.R 33.02,-20.32; 13.L 30.48,-17.78; 13.R 33.02,-17.78; 14.L 30.48,-15.24; 14.R 33.02,-15.24; 15.L 30.48,-12.7; 15.R 33.02,-12.7; 16.L 30.48,-10.16; 16.R 33.02,-10.16; 17.L 30.48,-7.62; 17.R 33.02,-7.62; 18.L 30.48,-5.08; 18.R 33.02,-5.08; 19.L 30.48,-2.54; 19.R 33.02,-2.54; 20.L 30.48,0; 20.R 33.02,0
32A_ATM = smd 1.5 x 0.4: 1 -4.25,2.8; 2 -4.25,2; 3 -4.25,1.2; 4 -4.25,0.4; 5 -4.25,-0.4; 6 -4.25,-1.2; 7 -4.25,-2; 8 -4.25,-2.8; 17 4.25,-2.8; 18 4.25,-2; 19 4.25,-1.2; 20 4.25,-0.4; 21 4.25,0.4; 22 4.25,1.2; 23 4.25,2; 24 4.25,2.8 | smd 0.4 x 1.5: 9 -2.8,-4.25; 10 -2,-4.25; 11 -1.2,-4.25; 12 -0.4,-4.25; 13 0.4,-4.25; 14 1.2,-4.25; 15 2,-4.25; 16 2.8,-4.25; 25 2.8,4.25; 26 2,4.25; 27 1.2,4.25; 28 0.4,4.25; 29 -0.4,4.25; 30 -1.2,4.25; 31 -2,4.25; 32 -2.8,4.25
SOT223 = smd 1.219 x 2.235: 1 -2.311,-3.099; 2 0,-3.099; 3 2.311,-3.099 | smd 3.6 x 2.2: 4.TAB 0,3.099
TXC7M2 = smd 1.2 x 1: 1 -1.2,-0.8; 2 1.2,-0.8; 3 1.2,0.8; 4 -1.2,0.8

### Placement (x,y rotation side)
$3_73_$  11.5,71.5 0 top
-  0,0 0 top
A1  83,91.5 0 top
A2  5,30 0 top
B1  21.5,10 0 top
B2  4.5,10 0 top
B3  32.5,68.5 270 top
B4  32.5,82 270 top
C1  53,23 90 top
C2  45.5,44 0 top
C3  45.5,42 0 top
C4  18,12 270 top
C5  86.5,72.5 270 top
C6  15.5,12 270 top
C7  59.1,61.3 180 top
C8  61.6,63.8 90 top
C9  53,64 270 top
C10  55,64 270 top
C11  43,67 0 top
C12  56.5,79.5 90 top
C13  43,79.5 0 top
C14  58.5,79.5 90 top
C15  43,73.5 0 top
C16  26,43.5 180 top
C17  26,41 180 top
C18  19,95 90 top
C19  22.5,95 90 top
C20  29.5,91.5 0 top
C21  28.5,82.5 0 top
C22  29.5,89.5 0 top
C23  28.5,80.5 0 top
C24  54.3,79.5 90 top
D1  13,92.5 180 top
D2  17,43.5 0 top
D3  17,36 0 top
D4  13,96 0 top
D5  17,41 0 top
D6  17,38.5 0 top
D7  13,89 0 top
J1  76,3.5 0 top
J2  96.5,21.5 270 top
J3  66.04,71.46 90 top
J4  58.36,91.46 0 top
J5  96.52,83.82 180 top
J6  35.5,91.46 0 top
J7  4.5,82 90 top
J8  5,39.5 0 top
LED1  50,17.5 0 top
LED2  69.54,59.46 180 top
LED3  26,36 0 top
R1  49,23 270 top
R2  47,23 270 top
R3  51,23 270 top
R4  26.5,18 180 top
R5  26.5,20 180 top
R6  88.5,72.5 270 top
R7  90.5,72.5 270 top
R8  26.5,24 0 top
R9  26.5,22 180 top
R10  43,65 180 top
R11  43,63 180 top
R12  69.54,61.46 0 top
R13  43,75.5 0 top
R14  43,77.5 180 top
R15  60.5,79.5 270 top
R16  26,38.5 180 top
U1  50,1.5 0 top
U2  19,32 0 top
U3  50,33 270 top
U4  96.5,73.65 270 top
U5  33.5,45 0 top
U6  54,72 90 top
U7  19,64.5 0 top
U8  22.5,89.5 90 top
U9  21.5,80.5 90 top
U$1  [MINIPCB_PANEL_IMAGEFRAME]  -26,-27 0 top  (outside the outline)
U$2  12.7,2.9 0 top
Y1  58.5,63.9 180 top

### Tracks (layer width: path | path; a pad name or v marks a point on that pad's centre or on a via)
3V3  (via drill 0.5 pad 0.9)
  Top 0.5: C22.1 U8.2 v22,89.5 U8.4.TAB 19.5,89.4 | v17,94.5 15.5,94.5 15.05,94.95 D4.A
  Bottom 0.5: v17,94.5 v22,89.5
5V0
  Top 0.5: D7.A 15.05,86.95 18.4,83.6 U9.4.TAB U9.2 C23.1
+3V3
  Top 0.5: D4.C 9.5,96 8.5,95 8.5,90.5 3,85 3,76.5 7,72.5 7,51.45 D2.C 7,43.5 5,41.5 J8.1 5,37 6,36 D3.C
+5V
  Top 0.5: D7.C 8.5,89 4,84.5 4,77 8,73 8,52 14.5,45.5 16,45.5 17,44.5 17,41.5 16.5,41 D5.C D6.C 13,38.5 12,39.5 J8.3
ADC6
  Top 0.3: U6.19 55.2,77.35 55.4,77.55 55.4,82.9 53.28,85.02 J6.8
  Bottom 0.5: J6.9 J6.8
ADC7
  Top 0.3: U6.22 52.8,77.4 51.1,79.1 51.1,81.01 50.74,81.37 J6.7
  Bottom 0.5: J6.10 J6.7
AREF
  Top 0.3: U6.20 54.4,77.4 54.3,77.5 C24.1
AT-USB-3V3
  Top 0.5: D2.A 19,43.55 19,45 10,54 10,63.5 11,64.5 U7.1.3V3
AT-USB-5V
  Top 0.5: D5.A 20.5,41 21,41.5 21,44.8 19,46.8 U7.6.5V
AT_DTR_CAP
  Top 0.3: U7.2.DTR 20.36,61.96 20.9,62.5 20.9,69.1 25.3,73.5 C15.1
AT_MISO  (via drill 0.5 pad 0.9)
  Top 0.3: U6.16 62.2,74.8 63,74 v62.98,73.98
  Bottom 0.3: v62.98,73.98 63,73.96 63,73 64.54,71.46 J3.1
AT_MOSI  (via drill 0.5 pad 0.9)
  Top 0.3: U6.15 59.5,74 60,73.5 v61,73.5
  Bottom 0.3: J3.4 66.97,75.61 61.62,75.61 61,75 v61,73.5
AT_RST  (via drill 0.5 pad 0.9)
  Top 0.3: R13.2 C15.2 43.95,72.4 44.51,71.84 v46.25,71.84 47.26,71.84 47.5,71.6 U6.29
  Bottom 0.3: J3.5 69.16,69.5 64.2,69.5 61.95,71.75 52.21,71.75 50.85,70.39 50.85,65.01 49.54,63.7 48.46,63.7 47.7,64.46 47.7,66.06 45.5,68.26 45.5,71.09 v46.25,71.84
AT_RST_CAP
  Top 0.3: R13.1 C13.1 R14.2
  Top 0.5: C13.1 41,79.5 39.5,79.5 B4.3.B B4.4.B
AT_RXD
  Top 0.3: U6.30 47.25,70.8 46.95,70.5 44.6,70.5 42.9,72.2 31.2,72.2 22,63 22,58 20.88,56.88 U7.4.RDO
AT_SCK
  Top 0.2: 56.8,69.2 57.7,68.3
  Top 0.3: J3.3 68.58,70.08 67.92,69.42 65.08,69.42 64.4,70.1 64.4,74.4 61.2,77.6 57.2,77.6 56.8,77.2 U6.17 56.8,69.2 | 57.7,68.3 60.72,68.3 63.45,65.57 65.73,65.57 68.6,62.7 R12.1
AT_TXD  (via drill 0.5 pad 0.9)
  Top 0.3: U6.31 47.55,70 47.35,69.8 44.4,69.8 42.55,71.65 31.43,71.65 23.5,63.72 v23.5,60.5
  Bottom 0.3: v23.5,60.5 22.42,59.42 U7.3.RXI
AVCC
  Top 0.3: U6.18 56,77.3 56.5,77.8 C12.1 C14.1 R15.2
B1-CAP
  Top 0.5: C4.1 19.55,14.5 B1.3.B B1.4.B 28,14.55 25.55,17 R4.2 R5.2
GND  (via drill 0.5 pad 0.9, 1.1)
  Top 0.3: U6.5 54.4,69.1 54,69.5 v53.6,69.5 53.2,69.5 52.8,69.1 U6.3 | v52.9,74.6 53.3,74.6 53.6,74.9 U6.21
  Top 0.5: C7.1 61.3,61.3 v61.5,61.5 61.6,61.6 C8.1
  other vias: 88.94,36.76 88.94,62.16 88.94,59.62 88.94,57.08 88.94,54.54 88.94,52 88.94,49.46 88.94,46.92 88.94,44.38 88.94,41.84 88.94,39.3 30.5,87.5 86.5,70 88.94,34.22 88.94,31.68 88.94,29.14 25,96 25,94 27,94 29,94 32.5,89.5 32.5,91.5 28,86.5 22,87.5 22,86 29.5,85 21,78.5 8,86.5 11,86.5 29.5,16.5 29.5,24.5 28.5,37 21.5,21 21.5,23 16.5,23 16.5,21 16,55.5 16,53.5 22,53.5 22,55.5 5.5,77.5 7,76 27,77.5 29.5,78.5 28.5,77.5 21,77 28.5,35 41,68.5 23,44 23,42 23,40 57.5,40.5 54.5,40.5 55,23.5 57,23.5 56,40.5 58.5,82.5 52,86 52,87.5 52,89 52.2,79.7 56.5,82.5 54.3,82.5 55.1,84.9 45.9,66.2 75.5,17.5 73.5,17.5 71.5,17.5 82.5,18.5 81,20 79.5,21.5 92.5,22.5 91,24 87.5,23.5 89,22 90.5,20.5 63,17 61,17 59,17 45,20 45,23 43,25 48,46 48,49 48,51.5 48,54 51,54 51,51.5 51,49 43,54 43,51.5 43,49 43,46 66.5,59.5 66.5,57.5 68,56.5 56,61 54,61 51.5,61 43,56.5 43,59 48,56.5 47.5,39 29,39.5 31.5,16.5 85,18.5 87.5,18.5 90,18.5 52.2,81.2 54.4,74.6 55.6,69.5 63.5,63 17,96 41,70 66.5,61.5 29.5,26.5 28,30.5 26.5,29 25,27.5 22,32.5 23.5,34 51,36.5 53,36.5 53,38 78,23 76.5,24.5 75,26 80,13 82,11 80,11 80,9 80,7 82,7 82,9 70,56.5 66,63 91,65.5 87.5,65.5 85,65.5 83,65.5 81,65.5 79,65.5 43.5,81.5 41.5,81.5 39.5,81.5 72,76.5 70,76.5 73.5,78.5 73.5,80.5 67.5,77 65,77 65.5,80.5 66.5,81.5 96.5,79 94.5,79 96.5,76 94.5,76 93.5,74.5 93,77.5 91.5,76 88,75.5 96,24.5 93.5,24.5 96,27 93.5,27 91,27 69.5,44 69.5,46 69.5,48 67.5,48 65.5,48 63.5,48 61.5,48 23,38 23,36 9.5,66.5 9.5,68.5 11,68.5 14,75.5 15.5,75.5 17.5,75.5 18.5,77 25.5,85 22,84.5 20,86 83.5,96.5 86,96.5 88.5,96.5 91,96.5 85.5,94.5 87.5,92.5 90,90 92.5,87.5 96.5,89.5 96.5,91.5 79.5,95 81.5,94 85.5,90 87.5,88 89.5,86 83.5,88 81,88 78.5,88 79.5,92 79.5,89.5 51.4,74.6
  pour Top (isolate 0.5): 2,2 98,2 98,98 2,98
  pour Bottom (isolate 0.5): 2,2 98,2 98,98 2,98
ICSP_CLK  (via drill 0.5 pad 0.9)
  Top 0.3: U3.18 58.17,36.17 61.92,39.92 U5.18.L U5.18.R 69.08,39.92 72.48,36.52 v72.48,28.52 | J1.5 86.16,10.84 74.5,22.5 v72.5,22.5
  Bottom 0.3: v72.5,22.5 72.5,28.5 v72.48,28.52
ICSP_DAT  (via drill 0.5 pad 0.9)
  Top 0.3: U3.19 57.45,37.45 62.46,42.46 U5.19.L U5.19.R 69.04,42.46 74,37.5 v74,27.5 | v74,20.5 75.5,20.5 83.62,12.38 J1.4
  Bottom 0.3: v74,20.5 v74,27.5
LED_POWER
  Top 0.5: R16.2 25.05,36.05 LED3.A
MCLR  (via drill 0.5 pad 0.9)
  Top 0.3: U5.4.L U5.4.R 39.12,37.38 41.59,34.91 U3.4 46.09,34.91 48,33 v48,30
  Top 0.5: R8.2 27.45,26.95 v31,30.5 | J1.1 76,12 79,15 79,16 76,19 63.5,19 56.5,26 54,26 53.5,26.5 v52.5,26.5
  Bottom 0.5: U5.4.L 31.88,37.38 31,36.5 v31,30.5 | v52.5,26.5 49,30 v48,30
MCLR_CAP
  Top 0.5: B2.3.B B2.4.B 13.95,14.5 C6.1 17,14.45 18,14.45 20.05,16.5 22,16.5 24,18.5 24,21.45 24.55,22 R9.2 R8.1
N$1  (via drill 1.1)  (1 unrouted)
  Top 0.5: v91.48,36.76 v96.56,36.76
  other vias: 94.02,36.76
N$2  (via drill 1.1)  (1 unrouted)
  Top 0.5: v91.48,39.3 v96.56,39.3
  other vias: 94.02,39.3
N$3  (via drill 1.1)  (1 unrouted)
  Top 0.5: v91.48,41.84 v96.56,41.84
  other vias: 94.02,41.84
N$4
  Top 0.5: LED1.2 48.4,18.1 48,18.5 48,19.5 49,20.5 R1.2
N$5
  Top 0.5: LED1.3 47.6,16.9 47,17.5 R2.2
N$6
  Top 0.5: LED1.1 51.6,18.1 52,18.5 52,19.5 51,20.5 R3.2
N$7  (via drill 1.1)  (1 unrouted)
  Top 0.5: v91.48,44.38 v96.56,44.38
  other vias: 94.02,44.38
N$8  (via drill 1.1)  (1 unrouted)
  Top 0.5: v91.48,46.92 v96.56,46.92
  other vias: 94.02,46.92
N$9  (via drill 1.1)  (1 unrouted)
  Top 0.5: v91.48,49.46 v96.56,49.46
  other vias: 94.02,49.46
N$10  (via drill 1.1)  (1 unrouted)
  Top 0.5: v91.48,52 v96.56,52
  other vias: 94.02,52
N$11  (via drill 1.1)  (1 unrouted)
  Top 0.5: v91.48,54.54 v96.56,54.54
  other vias: 94.02,54.54
N$12  (via drill 1.1)  (1 unrouted)
  Top 0.5: v91.48,57.08 v96.56,57.08
  other vias: 94.02,57.08
N$13  (via drill 1.1)  (1 unrouted)
  Top 0.5: v91.48,59.62 v96.56,59.62
  other vias: 94.02,59.62
N$14  (via drill 1.1)  (1 unrouted)
  Top 0.5: v91.48,62.16 v96.56,62.16
  other vias: 94.02,62.16
N$15
  Top 0.3: 60,63 60,61.5
N$16
  Top 0.3: 59.2,63.4 59,63.4 58,64.4 57.7,64.4
N$20  (via drill 1.1)  (1 unrouted)
  Top 0.5: v78.78,36.76 v83.86,36.76
  other vias: 81.32,36.76
N$21  (via drill 1.1)  (1 unrouted)
  Top 0.5: v78.78,39.3 v83.86,39.3
  other vias: 81.32,39.3
N$22  (via drill 1.1)  (1 unrouted)
  Top 0.5: v78.78,41.84 v83.86,41.84
  other vias: 81.32,41.84
N$23  (via drill 1.1)  (1 unrouted)
  Top 0.5: v78.78,44.38 v83.86,44.38
  other vias: 81.32,44.38
N$24  (via drill 1.1)  (1 unrouted)
  Top 0.5: v78.78,46.92 v83.86,46.92
  other vias: 81.32,46.92
N$25  (via drill 1.1)  (1 unrouted)
  Top 0.5: v78.78,49.46 v83.86,49.46
  other vias: 81.32,49.46
N$26  (via drill 1.1)  (1 unrouted)
  Top 0.5: v78.78,52 v83.86,52
  other vias: 81.32,52
N$27  (via drill 1.1)  (1 unrouted)
  Top 0.5: v78.78,54.54 v83.86,54.54
  other vias: 81.32,54.54
N$28  (via drill 1.1)  (1 unrouted)
  Top 0.5: v83.86,57.08 v78.78,57.08
  other vias: 81.32,57.08
N$29  (via drill 1.1)
  Top 0.3: v81.32,59.62 v83.86,59.62
  Top 0.5: v78.78,59.62 v83.86,59.62
N$30  (via drill 1.1)
  Top 0.5: v78.78,62.16 v81.32,62.16 v83.86,62.16
N$33  (via drill 1.1)
  Top 0.406: v83.86,71.08 v83.86,73.62 v83.86,76.16
  Bottom 0.5: v83.86,76.16 83.86,83.78 J5.6 J5.11
N$34  (via drill 1.1)
  Top 0.406: v81.32,71.08 v81.32,73.62 v81.32,76.16
  Bottom 0.5: v81.32,76.16 81.32,83.78 J5.7 J5.10
N$35  (via drill 1.1)
  Top 0.406: v78.78,71.08 v78.78,73.62 v78.78,76.16
  Bottom 0.5: v78.78,76.16 78.78,83.78 J5.8 J5.9
N$37
  Top 0.5: R12.2 70.49,59.51 LED2.A
N$39  (via drill 1.1)  (1 unrouted)
  Top 0.5: v78.78,29.14 v83.86,29.14
  other vias: 81.32,29.14
N$40  (via drill 1.1)  (1 unrouted)
  Top 0.5: v78.78,31.68 v83.86,31.68
  other vias: 81.32,31.68
N$41  (via drill 1.1)  (1 unrouted)
  Top 0.5: v78.78,34.22 v83.86,34.22
  other vias: 81.32,34.22
N$42  (via drill 1.1)  (1 unrouted)
  Top 0.5: v91.48,29.14 v96.56,29.14
  other vias: 94.02,29.14
N$43  (via drill 1.1)  (1 unrouted)
  Top 0.5: v91.48,31.68 v96.56,31.68
  other vias: 94.02,31.68
N$44  (via drill 1.1)  (1 unrouted)
  Top 0.5: v91.48,34.22 v96.56,34.22
  other vias: 94.02,34.22
PB0
  Top 0.3: U6.12 59.4,71.6 59.95,71.05 61.12,71.05 64.4,67.77 68.6,67.77 69.13,68.3 72.06,68.3 74.3,70.54 74.3,75.74 76.76,78.2 88.36,78.2 J5.14
  Bottom 0.5: J5.3 J5.14
PB1
  Top 0.3: U6.13 59.4,72.4 60.2,71.6 61.34,71.6 64.62,68.32 68.38,68.32 68.91,68.85 71.83,68.85 73.75,70.77 73.75,75.97 76.53,78.75 86.37,78.75 J5.13
  Bottom 0.5: J5.4 J5.13
PB2
  Top 0.3: U6.14 59.4,73.2 60.4,72.2 61.52,72.2 64.85,68.87 68.15,68.87 68.68,69.4 71.6,69.4 73.2,71 73.2,76.2 76.3,79.3 84.4,79.3 86.36,81.26 J5.12
  Bottom 0.5: J5.5 J5.12
PC0
  Top 0.3: U6.23 52,77.4 50.55,78.85 50.55,80.78 48.2,83.13 J6.6
  Bottom 0.5: J6.11 J6.6
PC1
  Top 0.3: U6.24 51.2,77.4 50,78.6 50,80.56 45.66,84.9 J6.5
  Bottom 0.5: J6.12 J6.5
PC2
  Top 0.3: U6.25 48.9,74.8 48.7,75 48.7,75.82 49.45,76.57 49.45,80.33 43.12,86.66 J6.4
  Bottom 0.5: J6.13 J6.4
PC3
  Top 0.3: U6.26 48.4,74 48.1,74.3 48.1,76 48.9,76.8 48.9,80.1 40.58,88.42 J6.3
  Bottom 0.5: J6.14 J6.3
PD2  (via drill 0.5 pad 0.9)
  Top 0.3: U6.32 48.4,69.2 v47.5,68.3 | J4.3 63.44,85.44 62.5,84.5 v62.5,81.5
  Bottom 0.3: v47.5,68.3 47.5,69.6 51.45,73.55 55.87,73.55 62.5,80.18 v62.5,81.5
  Bottom 0.5: J4.14 J4.3
PD3  (via drill 0.5 pad 0.9)
  Top 0.3: U6.1 51.2,66.8 50.5,66.1 49.9,66.1 v49,67 | J4.4 66,91.44 66,86 64,84 v64,82.5
  Bottom 0.3: v49,67 49,70.3 51.7,73 56.5,73 64,80.5 v64,82.5
  Bottom 0.5: J4.13 J4.4
PD4  (via drill 0.5 pad 0.9)
  Top 0.3: R10.1 v49,65 50.5,65 52,66.5 U6.2 | J4.5 68.52,87.02 65.3,83.8 65.3,81.96 64,80.66 v64,78.5
  Bottom 0.3: v49,65 50.2,66.2 50.2,70.62 51.98,72.4 57,72.4 63.1,78.5 v64,78.5
  Bottom 0.5: J4.12 J4.5
PD4-CAP
  Top 0.3: B3.4.B 39.5,62 40.5,63 R11.2 | C11.1 R10.2
  Top 0.5: R11.2 R10.2 | B3.4.B B3.3.B
PD5  (via drill 0.5 pad 0.9)
  Top 0.3: U6.9 60.6,69.2 63.68,66.12 69.29,66.12 69.82,66.65 72.74,66.65 75.09,69 v76.5,69
  Bottom 0.3: v76.5,69 75,70.5 75,73.22 74.45,73.77 74.45,76.23 74.86,76.64 74.86,85.64 71.06,89.44 J4.6
  Bottom 0.5: J4.11 J4.6
PD6  (via drill 0.5 pad 0.9)
  Top 0.3: U6.10 59.4,70 59.6,69.8 60.81,69.8 63.94,66.67 69.06,66.67 69.59,67.2 72.51,67.2 75.4,70.09 75.4,71.4 v76.5,72.5
  Bottom 0.3: v76.5,72.5 75,74 75,76 75.5,76.5 75.5,87.5 73.6,89.4 J4.7
  Bottom 0.5: J4.10 J4.7
PD7  (via drill 0.5 pad 0.9)
  Top 0.3: U6.11 59.4,70.8 59.7,70.5 60.89,70.5 64.17,67.22 68.83,67.22 69.36,67.75 72.28,67.75 74.85,70.32 74.85,74.5 75.35,75 v76.5,75
  Bottom 0.3: v76.5,75 76.5,89 76.14,89.36 J4.8
  Bottom 0.5: J4.9 J4.8
PIC-USB-3V3
  Top 0.5: D3.A 19.05,32.05 U2.1.3V3
PIC-USB-5V
  Top 0.5: D6.A 17.5,38.5 17,38 17,34.5 15,32.5 15,20.5 16.2,19.3 U2.6.5V
RA2
  Top 0.3: U3.17 58.91,34.91 61.38,37.38 U5.17.L U5.17.R
  Top 0.5: U3.17 52.41,34.91 50.5,33 50.5,27.98 51,27.48 R3.1
RA4
  Top 0.3: U3.3 42.33,36.17 38.58,39.92 U5.3.R U5.3.L
  Bottom 0.3: U1.1 35.64,14.86 31,19.5 31,27 29.5,28.5 29.5,34.16 29.8,34.46 29.8,37.8 31.92,39.92 U5.3.L
RA5  (via drill 0.5 pad 0.9)
  Top 0.3: U3.2 43.05,37.45 38.04,42.46 U5.2.R U5.2.L
  Top 0.5: R2.1 47,25 v46.5,25.5 | v49.5,26.5 49.5,35 47.05,37.45 U3.2
  Bottom 0.5: v46.5,25.5 47.5,26.5 v49.5,26.5
RB5
  Top 0.3: U3.12 57.45,28.55 61.32,24.68 U5.12.L U5.12.R 73.16,24.68 86.5,11.34 J2.5
RB7
  Top 0.3: U3.10 43.28,27.29 38.14,22.14 U5.10.R U5.10.L
  Top 0.5: U5.10.L 29.36,18 R4.1
RC0
  Top 0.3: U3.16 59.63,33.63 60.84,34.84 U5.16.L U5.16.R
  Bottom 0.3: U1.4 70,12.54 70,33 68.16,34.84 U5.16.R
RC1
  Top 0.3: U3.15 63.91,32.37 U5.15.L U5.15.R
  Bottom 0.3: U1.3 69,19.84 69,31.5 68.2,32.3 U5.15.R
RC2
  Top 0.3: U3.14 58.91,31.09 60.24,29.76 U5.14.L U5.14.R 69.24,29.76 82.58,16.42 J2.3
RC3  (via drill 0.5 pad 0.9)
  Top 0.3: U3.7 41.09,31.09 39.76,29.76 U5.7.R U5.7.L | v43.5,16 45,16 45.5,15.5 v77.5,15.5
  Bottom 0.3: U5.7.L 31.55,27.81 31.55,19.95 35.5,16 v43.5,16 | v77.5,15.5 93,15.5 94.62,13.88 J2.4
RC4
  Top 0.3: U3.6 36.1,32.37 U5.6.R U5.6.L
  Top 0.5: U2.3.RXI 21.42,26.92 26.8,32.3 U5.6.L
RC5  (via drill 0.5 pad 0.9)
  Top 0.3: U3.5 40.87,33.63 39.66,34.84 U5.5.R U5.5.L
  Top 0.5: U2.4.RDO 20.88,24.38 v22,25.5 | U5.5.L 31.84,34.84 30.5,33.5 26,33.5 v22,29.5
  Bottom 0.5: v22,29.5 v22,25.5
RC6
  Top 0.3: U3.8 41.83,29.82 39.22,27.22 U5.8.R U5.8.L
  Top 0.5: R1.1 49,25 47,27 47,29 46.17,29.82 U3.8
RC7
  Top 0.3: U3.9 42.55,28.55 38.68,24.68 U5.9.R U5.9.L
  Bottom 0.3: U5.9.R 38.32,24.68 45.34,17.66 U1.2
  Bottom 0.406: 45.34,10.16 U1.2
SCL  (via drill 0.5 pad 0.9)
  Top 0.3: $3_73_$.3.SCL 20.58,75.5 28.72,75.5 31.77,78.55 33.55,78.55 v34.5,79.5 | v47.5,79.5 46.2,78.2 46.2,76.96 46.95,76.21 46.95,73.55 48.1,72.4 U6.28 | U5.11.R U5.11.L 61.86,22.14 56.72,27.29 U3.11 53.72,27.29 52,29 v52,30 | v75.48,67.48 89.48,67.48 90.5,68.5 | v48,58.5 v48,61.5
  Top 0.5: U4.4 92.97,66.03 90.5,68.5 R7.2
  Bottom 0.3: v34.5,79.5 v47.5,79.5 48.9,78.1 48.9,76.8 48.3,76.2 45.87,76.2 43.5,73.83 43.5,63.16 45.16,61.5 v48,61.5 49.65,63.15 49.77,63.15 51.5,64.88 51.5,70.17 52.53,71.2 61.72,71.2 63.97,68.95 74.05,68.95 75.5,67.5 v75.48,67.48 | v52,30 50.5,31.5 50.5,32.72 49.24,33.98 49.24,57.26 v48,58.5
SDA  (via drill 0.5 pad 0.9)
  Top 0.3: $3_73_$.4.SDA 22.27,74.65 29.15,74.65 32,77.5 v34.5,77.5 | v47.5,77.5 47.5,74 48.3,73.2 U6.27 | U5.13.R U5.13.L 60.78,27.22 58.17,29.82 U3.13 54.17,29.82 53.5,30.5 53.5,31.5 53,32 v52,32 | v79.9,68.9 85.76,68.9 85.96,68.7 87.2,68.7 v88.5,70
  Top 0.5: U4.3 93.43,68.57 v92,70 | v88.5,70 R6.2
  Bottom 0.3: v34.5,77.5 35.5,78.5 46.5,78.5 v47.5,77.5 45.9,77.5 42.45,74.06 42.45,62.93 45.23,60.15 49.79,60.15 | v79.9,68.9 78.74,68.9 76.02,66.18 74.92,66.18 72.7,68.4 63.7,68.4 61.51,70.59 52.8,70.59 52.13,69.92 52.13,64.74 49.79,62.4 49.79,60.15 | v52,32 49.79,34.21 49.79,60.15
  Bottom 0.5: v92,70 v88.5,70
UNREG_IN
  Top 0.5: D1.A 11,92.5 13,90.5 13,86 13.79,85.21 J7.TIP
UNREG_IN_POLARITY_PROTECTED
  Top 0.5: C20.1 27.5,91.5 27.19,91.81 U8.3 23.69,91.81 22.5,93 C19.1 C18.1 17.45,92.5 D1.C 17.5,90.05 17.5,86.5 21.19,82.81 U9.3 26.19,82.81 26.5,82.5 C21.1
VDD  (via drill 0.5 pad 0.9, 1.1)
  Top 0.3: U3.1 43.28,38.72 43,39 43,40.45 C3.1 C2.1 | U5.1.L U5.1.R | U6.6 55.2,66.2 55,66 C10.1 | U6.4 53.6,66.6 53,66 C9.1 | J4.2 60.9,82 60.5,81.6 R15.1 61.55,80.45 62.5,79.5 62.5,77.54 J3.2
  Top 0.5: C16.1 27,43.55 27.05,43.5 29.5,43.5 31,45 U5.1.L | R16.1 C17.1 C16.1 | R5.1 R9.1 v29.5,22 | LED1.4 51.9,16.9 53,18 C1.1 54.45,22.05 v55,21.5 | $3_73_$.2.VDD 14.04,69.04 9,64 9,53 v15,47 | v8.5,34.5 11,34.5 13.95,31.55 13.95,19.99 16.29,17.65 20.65,17.65 v22,19 | C16.1 26.95,44.55 26,45.5 22.5,45.5 v21,47 | J1.2 78.54,11.46 v78,12 | J2.2 94.04,18.96 86.4,26.6 v86.4,29.14 v86.4,31.68 v86.4,34.22 v86.4,36.76 v86.4,39.3 v86.4,41.84 v86.4,44.38 v86.4,46.92 v86.4,49.46 v86.4,52 v86.4,54.54 v86.4,57.08 v86.4,59.62 v86.4,62.16 | U4.2 94.39,71.11 92.05,73.45 R7.1 R6.1 C5.1 86.5,76 87.55,77.05 88.63,77.05 90.58,79 91.7,79 J5.15 J5.2 81.3,96.5 61.8,96.5 60.9,95.6 | U5.1.R 41.5,45 v42.5,44 C2.1 44.55,60.45 43.95,61.05 R11.1 v45.5,63 50,63 51.95,64.95 C9.1 C10.1 | v45.65,73.64 45.65,76.01 44.76,76.9 44.55,76.9 R14.1 44.55,78.1 44.76,78.1 46,79.34 46,81.5 38.04,89.46 J6.2 J6.15 38.04,95.54 39,96.5 60,96.5 60.9,95.6 | 60.9,95.6 J4.15 J4.2
  Bottom 0.5: v8.5,34.5 7.54,35.46 J8.2 7.54,41.54 13,47 v15,47 v21,47 | v22,19 26.5,19 v29.5,22 | v86.4,62.16 86.4,63.4 87,64 93,64 94.5,65.5 94.5,70.5 95.11,71.11 U4.2 | v78,12 76,14 76,16 77,17 79,17 79.5,16.5 91.7,16.5 94.16,18.96 J2.2 | v42.5,44 42.5,27.5 48.5,21.5 v55,21.5 | v45.65,73.64 44.65,72.64 44.65,63.85 v45.5,63
XTAL1
  Top 0.25: C7.2 57.3,62.3 Y1.3
  Top 0.3: Y1.3 56.6,63.1 56.2,63.5 56.2,66.4 56,66.6 U6.7
XTAL2
  Top 0.25: C8.2 59.8,64.6 59.45,64.95
  Top 0.3: 59.6,64.8 59.7,64.9 59.7,65.4 58.6,66.5 57.1,66.5 56.8,66.8 U6.8 | 59.45,64.95 59.6,64.8 | 59.6,64.8 Y1.1 59.8,64.8

### Text on the board
tPlace: RESET | VDD | GND | PD4 | ATmega328P-AU | PIC16F1829 | 5V | 3V3 | VDD | GND | HELLO WORLD! | RESET | RB7
bPlace: REV A2
_tNames: D4 | D1 | C18 | C19 | C20 | D7 | C22 | U8 | C21 | C24 | C12 | C14 | R15 | C13 | J7 | C23 | R14 | U9 | R13 | C5 | R6 | R7 | C15 | J3 | U6 | C11 | R10 | C8 | R11 | R12 | C9 | C10 | Y1 | C7 | LED2 | D2 | C16 | C2 | J8 | C3 | D5 | C17 | U3 | D6 | R16 | D3 | LED3 | R8 | R9 | R2 | R1 | R3 | C1 | R5 | R4 | LED1 | C6 | C4